# EAGLE design CN-Cape005-via08 (EAGLE 7.2.0)

## Sheet 1 of 7: Spannungsversorgung Verpolungsschutz ? Größe der Sicherung ? 1A oder 3A für Servos?
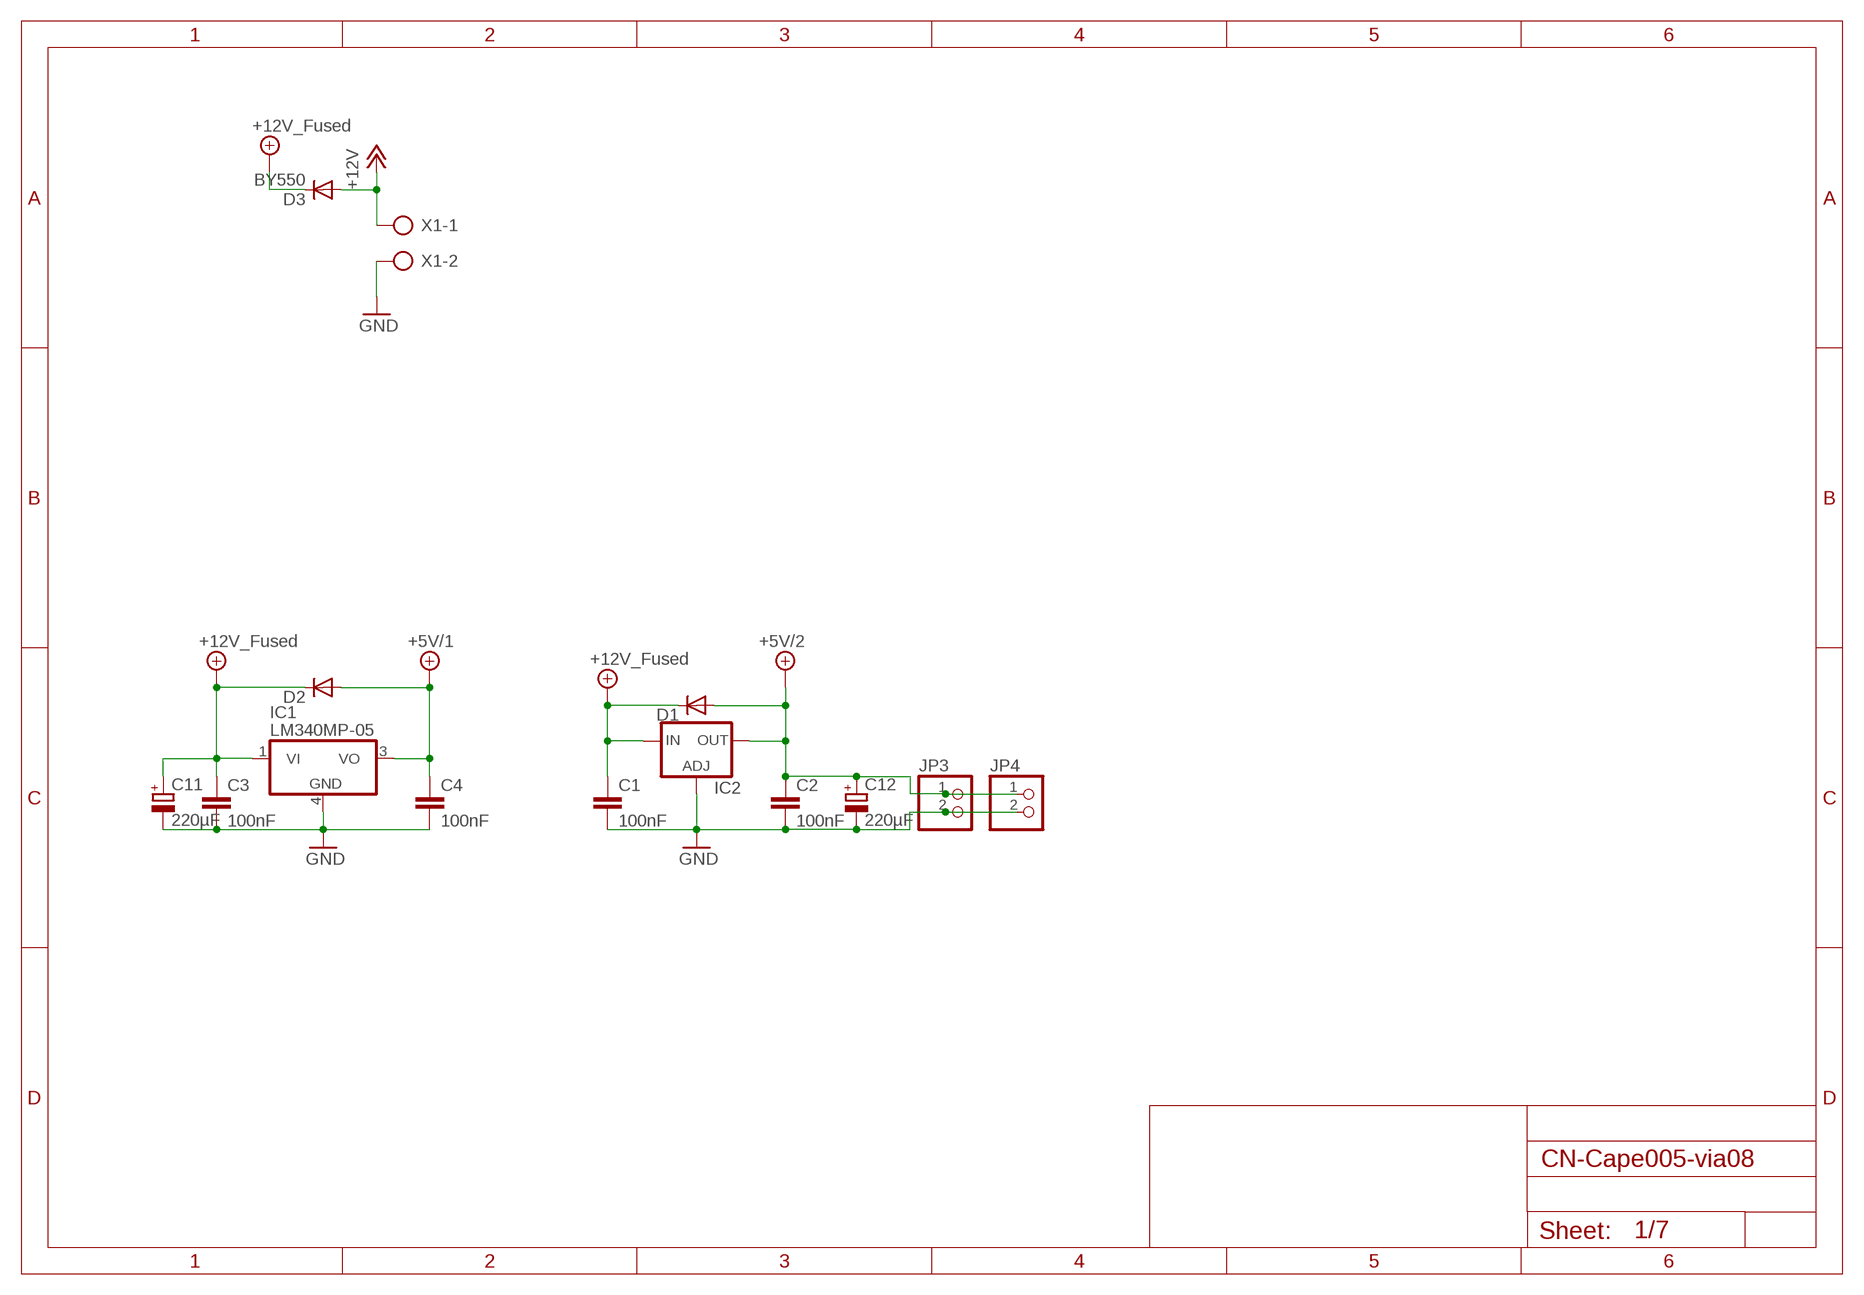
[diagram p0: schematic, sheet 1]

### Parts
C1  100nF  C-EUC0603  [C0603]
C2  100nF  C-EUC0603  [C0603]
C3  100nF  C-EUC0603  [C0603]
C4  100nF  C-EUC0603  [C0603]
C11  220µF  CPOL-EUE3.5-8  [E3,5-8]
C12  220µF  CPOL-EUE3.5-8  [E3,5-8]
D1  DIODE-SOD123  [SOD123]
D2  DIODE-SOD123  [SOD123]
D3  BY550  [DO27-15]
IC1  LM340MP-05  [SOT223]
IC2  LM138-TL  [TO220L1]
JP3  PINHD-1X2  [1X02]
JP4  PINHD-1X2  [1X02]
X1  AK500/2-H  [AK500/2-H]

### Nets
+5V/1: C4.1 D2.A IC1.3(VO) ; also sheet 2,3,4,5
+5V/2: C2.1 C12.+ D1.A IC2.2(OUT) JP3.1 JP4.1 ; also sheet 5
+10V: C1.1 C3.1 C11.+ D1.C D2.C D3.C IC1.1(VI) IC2.3(IN) ; supply symbol labelled +12V_Fused
+12V: D3.A X1.1
GND: C1.2 C2.2 C3.2 C4.2 C11.- C12.- IC1.4(GND) IC2.1(ADJ) JP3.2 JP4.2 X1.2 ; also sheet 2,3,4,5,6,7

## Sheet 2 of 7: BeagleBoard Black Expansion Header
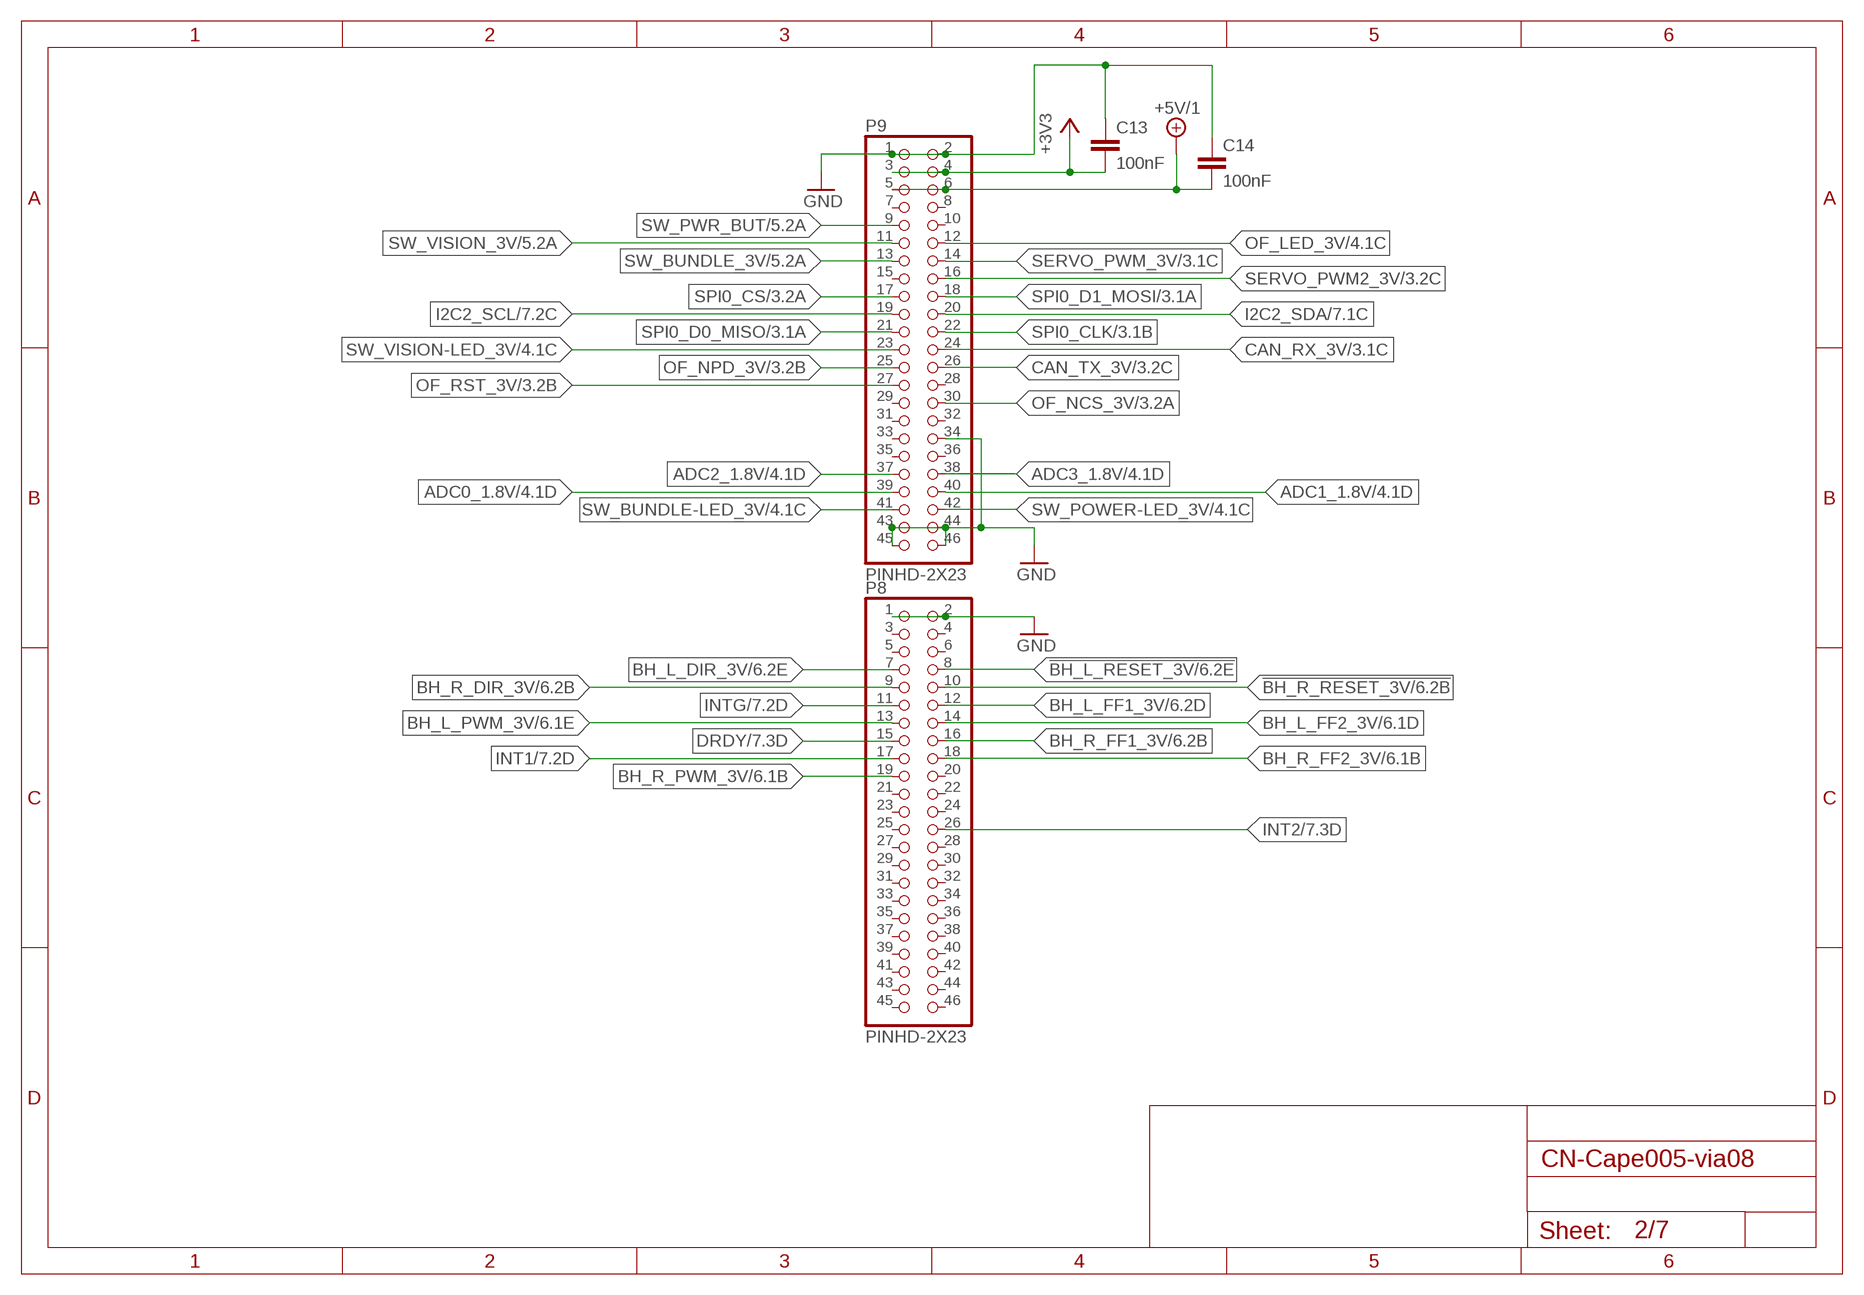
[diagram p1: schematic, sheet 2]

### Parts
C13  100nF  C-EUC0603  [C0603]
C14  100nF  C-EUC0603  [C0603]
P8  PINHD-2X23  [2X23]
P9  PINHD-2X23  [2X23]

### Nets
!BH_L_RESET_3V: P8.8 ; also sheet 6
!BH_R_RESET_3V: P8.10 ; also sheet 6
+3V3: C13.2 P9.3 P9.4 ; also sheet 3,6,7
+5V/1: C14.2 P9.5 P9.6 ; also sheet 1,3,4,5
ADC0_1.8V: P9.39 ; also sheet 4
ADC1_1.8V: P9.40 ; also sheet 4
ADC2_1.8V: P9.37 ; also sheet 4
ADC3_1.8V: P9.38 ; also sheet 4
BH_L_DIR_3V: P8.7 ; also sheet 6
BH_L_FF1_3V: P8.12 ; also sheet 6
BH_L_FF2_3V: P8.14 ; also sheet 6
BH_L_PWM_3V: P8.13 ; also sheet 6
BH_R_DIR_3V: P8.9 ; also sheet 6
BH_R_FF1_3V: P8.16 ; also sheet 6
BH_R_FF2_3V: P8.18 ; also sheet 6
BH_R_PWM_3V: P8.19 ; also sheet 6
CAN_RX_3V: P9.24 ; also sheet 3
CAN_TX_3V: P9.26 ; also sheet 3
DRDY: P8.15 ; also sheet 7
GND: C13.1 C14.1 P8.1 P8.2 P9.1 P9.2 P9.34 P9.43 P9.44 P9.45 P9.46 ; also sheet 1,3,4,5,6,7
I2C2_SCL: P9.19 ; also sheet 7
I2C2_SDA: P9.20 ; also sheet 7
INT1: P8.17 ; also sheet 7
INT2: P8.26 ; also sheet 7
INTG: P8.11 ; also sheet 7
OF_LED_3V: P9.12 ; also sheet 4
OF_NCS_3V: P9.30 ; also sheet 3
OF_NPD_3V: P9.25 ; also sheet 3
OF_RST_3V: P9.27 ; also sheet 3
SERVO_PWM2_3V: P9.16 ; also sheet 3
SERVO_PWM_3V: P9.14 ; also sheet 3
SPI0_CLK: P9.22 ; also sheet 3
SPI0_CS: P9.17 ; also sheet 3
SPI0_D0_MISO: P9.21 ; also sheet 3
SPI0_D1_MOSI: P9.18 ; also sheet 3
SW_BUNDLE-LED_3V: P9.41 ; also sheet 4
SW_BUNDLE_3V: P9.13 ; also sheet 5
SW_POWER-LED_3V: P9.42 ; also sheet 4
SW_PWR_BUT: P9.9 ; also sheet 5
SW_VISION-LED_3V: P9.23 ; also sheet 4
SW_VISION_3V: P9.11 ; also sheet 5
Unconnected: P8.3 P8.4 P8.5 P8.6 P8.20 P8.21 P8.22 P8.23 P8.24 P8.25 P8.27 P8.28 P8.29 P8.30 P8.31 P8.32 P8.33 P8.34 P8.35 P8.36 P8.37 P8.38 P8.39 P8.40 P8.41 P8.42 P8.43 P8.44 P8.45 P8.46 P9.7 P9.8 P9.10 P9.15 P9.28 P9.29 P9.31 P9.32 P9.33 P9.35 P9.36

## Sheet 3 of 7: Level Shifter
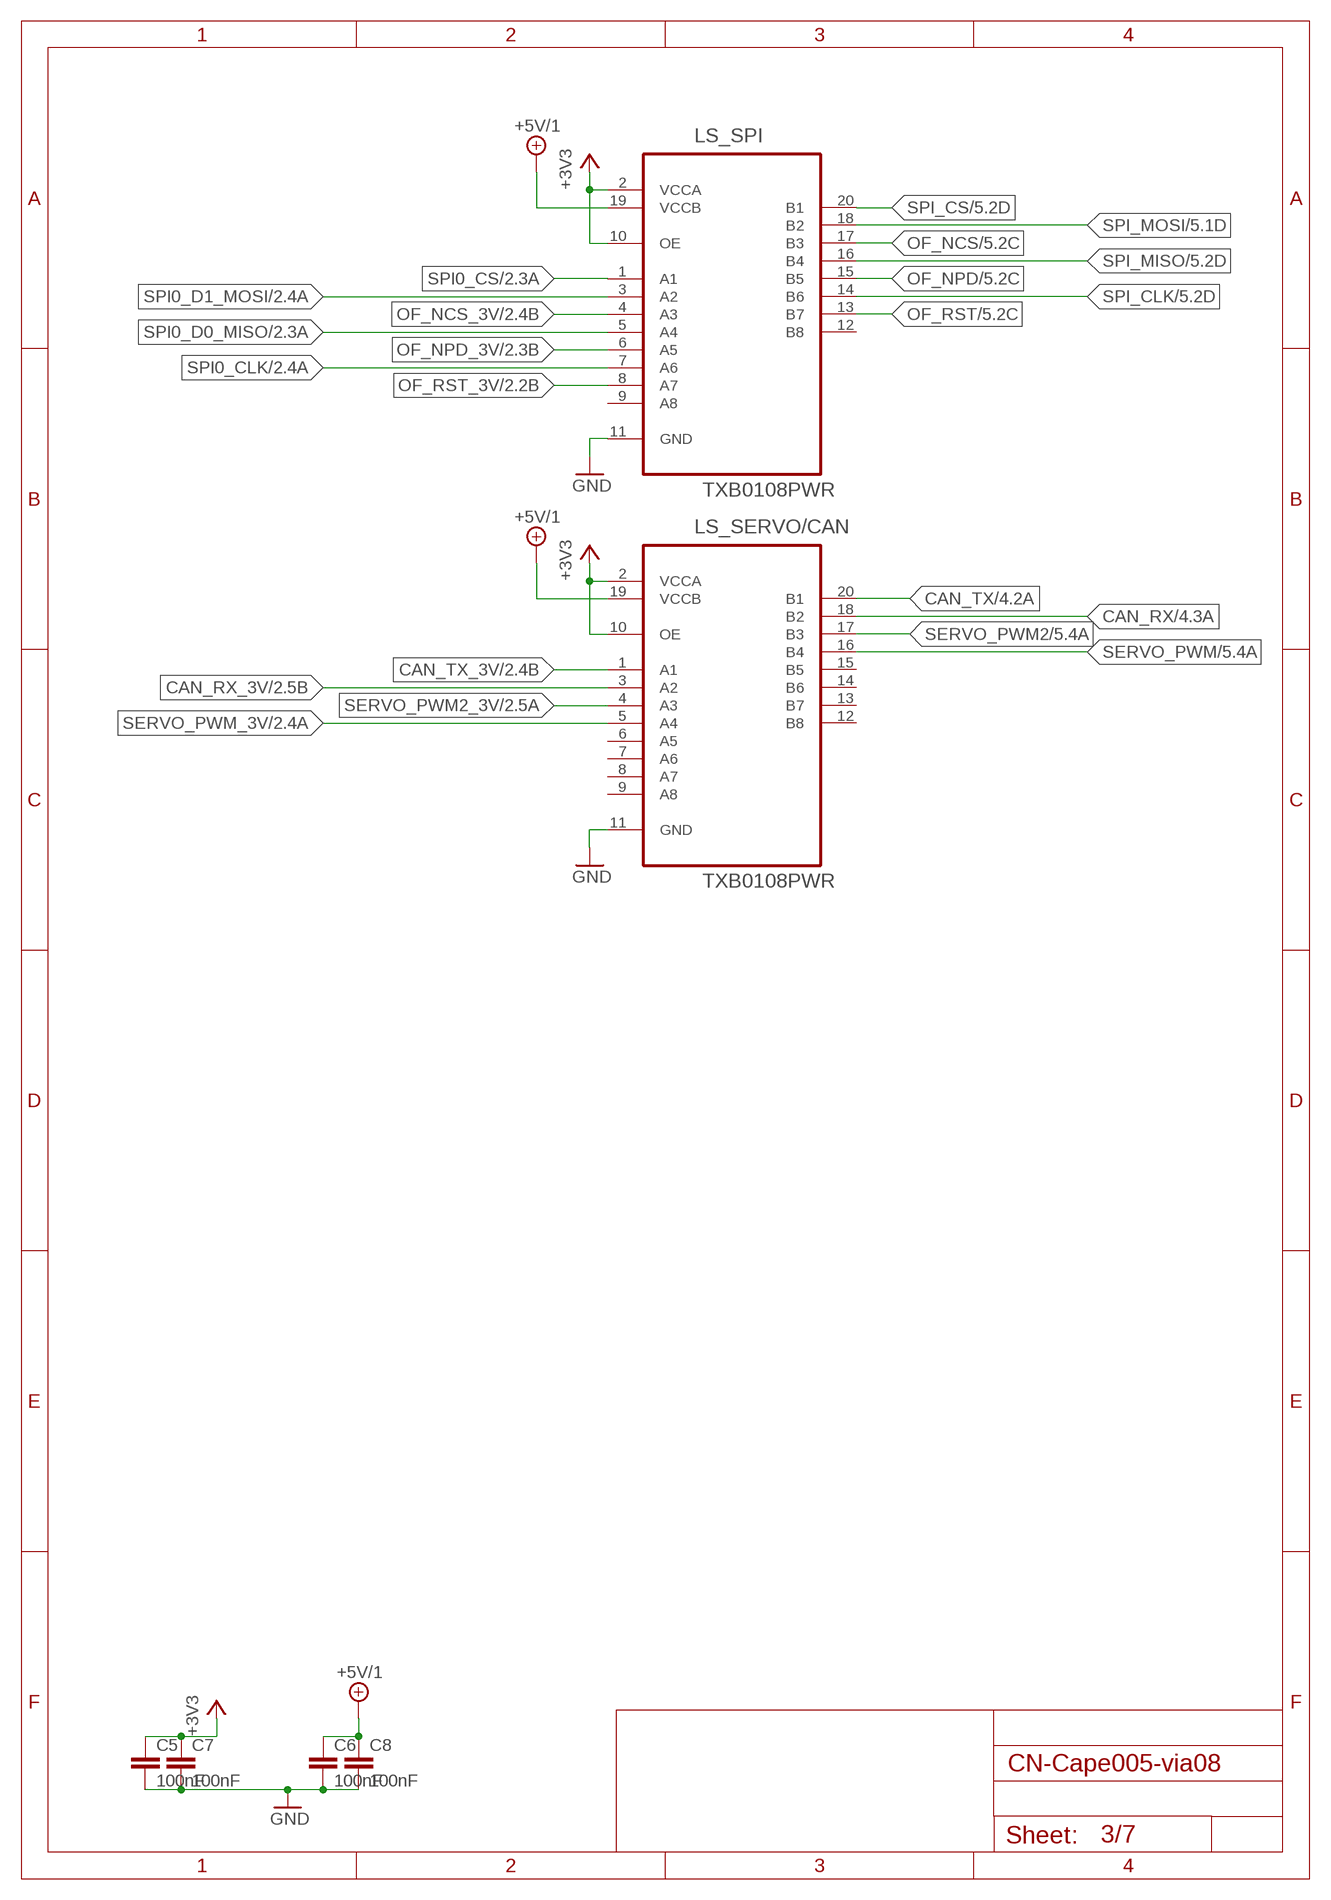
[diagram p2: schematic, sheet 3]

### Parts
C5  100nF  C-EUC0603  [C0603]
C6  100nF  C-EUC0603  [C0603]
C7  100nF  C-EUC0603  [C0603]
C8  100nF  C-EUC0603  [C0603]
LS_SERVO/CAN  TXB0108PWR  [SOP65P640X120-20N]
LS_SPI  TXB0108PWR  [SOP65P640X120-20N]

### Nets
+3V3: C5.1 C7.1 LS_SERVO/CAN.2(VCCA) LS_SERVO/CAN.10(OE) LS_SPI.2(VCCA) LS_SPI.10(OE) ; also sheet 2,6,7
+5V/1: C6.1 C8.1 LS_SERVO/CAN.19(VCCB) LS_SPI.19(VCCB) ; also sheet 1,2,4,5
CAN_RX: LS_SERVO/CAN.18(B2) ; also sheet 4
CAN_RX_3V: LS_SERVO/CAN.3(A2) ; also sheet 2
CAN_TX: LS_SERVO/CAN.20(B1) ; also sheet 4
CAN_TX_3V: LS_SERVO/CAN.1(A1) ; also sheet 2
GND: C5.2 C6.2 C7.2 C8.2 LS_SERVO/CAN.11(GND) LS_SPI.11(GND) ; also sheet 1,2,4,5,6,7
OF_NCS: LS_SPI.17(B3) ; also sheet 5
OF_NCS_3V: LS_SPI.4(A3) ; also sheet 2
OF_NPD: LS_SPI.15(B5) ; also sheet 5
OF_NPD_3V: LS_SPI.6(A5) ; also sheet 2
OF_RST: LS_SPI.13(B7) ; also sheet 5
OF_RST_3V: LS_SPI.8(A7) ; also sheet 2
SERVO_PWM: LS_SERVO/CAN.16(B4) ; also sheet 5
SERVO_PWM2: LS_SERVO/CAN.17(B3) ; also sheet 5
SERVO_PWM2_3V: LS_SERVO/CAN.4(A3) ; also sheet 2
SERVO_PWM_3V: LS_SERVO/CAN.5(A4) ; also sheet 2
SPI0_CLK: LS_SPI.7(A6) ; also sheet 2
SPI0_CS: LS_SPI.1(A1) ; also sheet 2
SPI0_D0_MISO: LS_SPI.5(A4) ; also sheet 2
SPI0_D1_MOSI: LS_SPI.3(A2) ; also sheet 2
SPI_CLK: LS_SPI.14(B6) ; also sheet 5
SPI_CS: LS_SPI.20(B1) ; also sheet 5
SPI_MISO: LS_SPI.16(B4) ; also sheet 5
SPI_MOSI: LS_SPI.18(B2) ; also sheet 5
Unconnected: LS_SERVO/CAN.6(A5) LS_SERVO/CAN.7(A6) LS_SERVO/CAN.8(A7) LS_SERVO/CAN.9(A8) LS_SERVO/CAN.12(B8) LS_SERVO/CAN.13(B7) LS_SERVO/CAN.14(B6) LS_SERVO/CAN.15(B5) LS_SPI.9(A8) LS_SPI.12(B8)

## Sheet 4 of 7: CAN- Bus & LED Transistoren
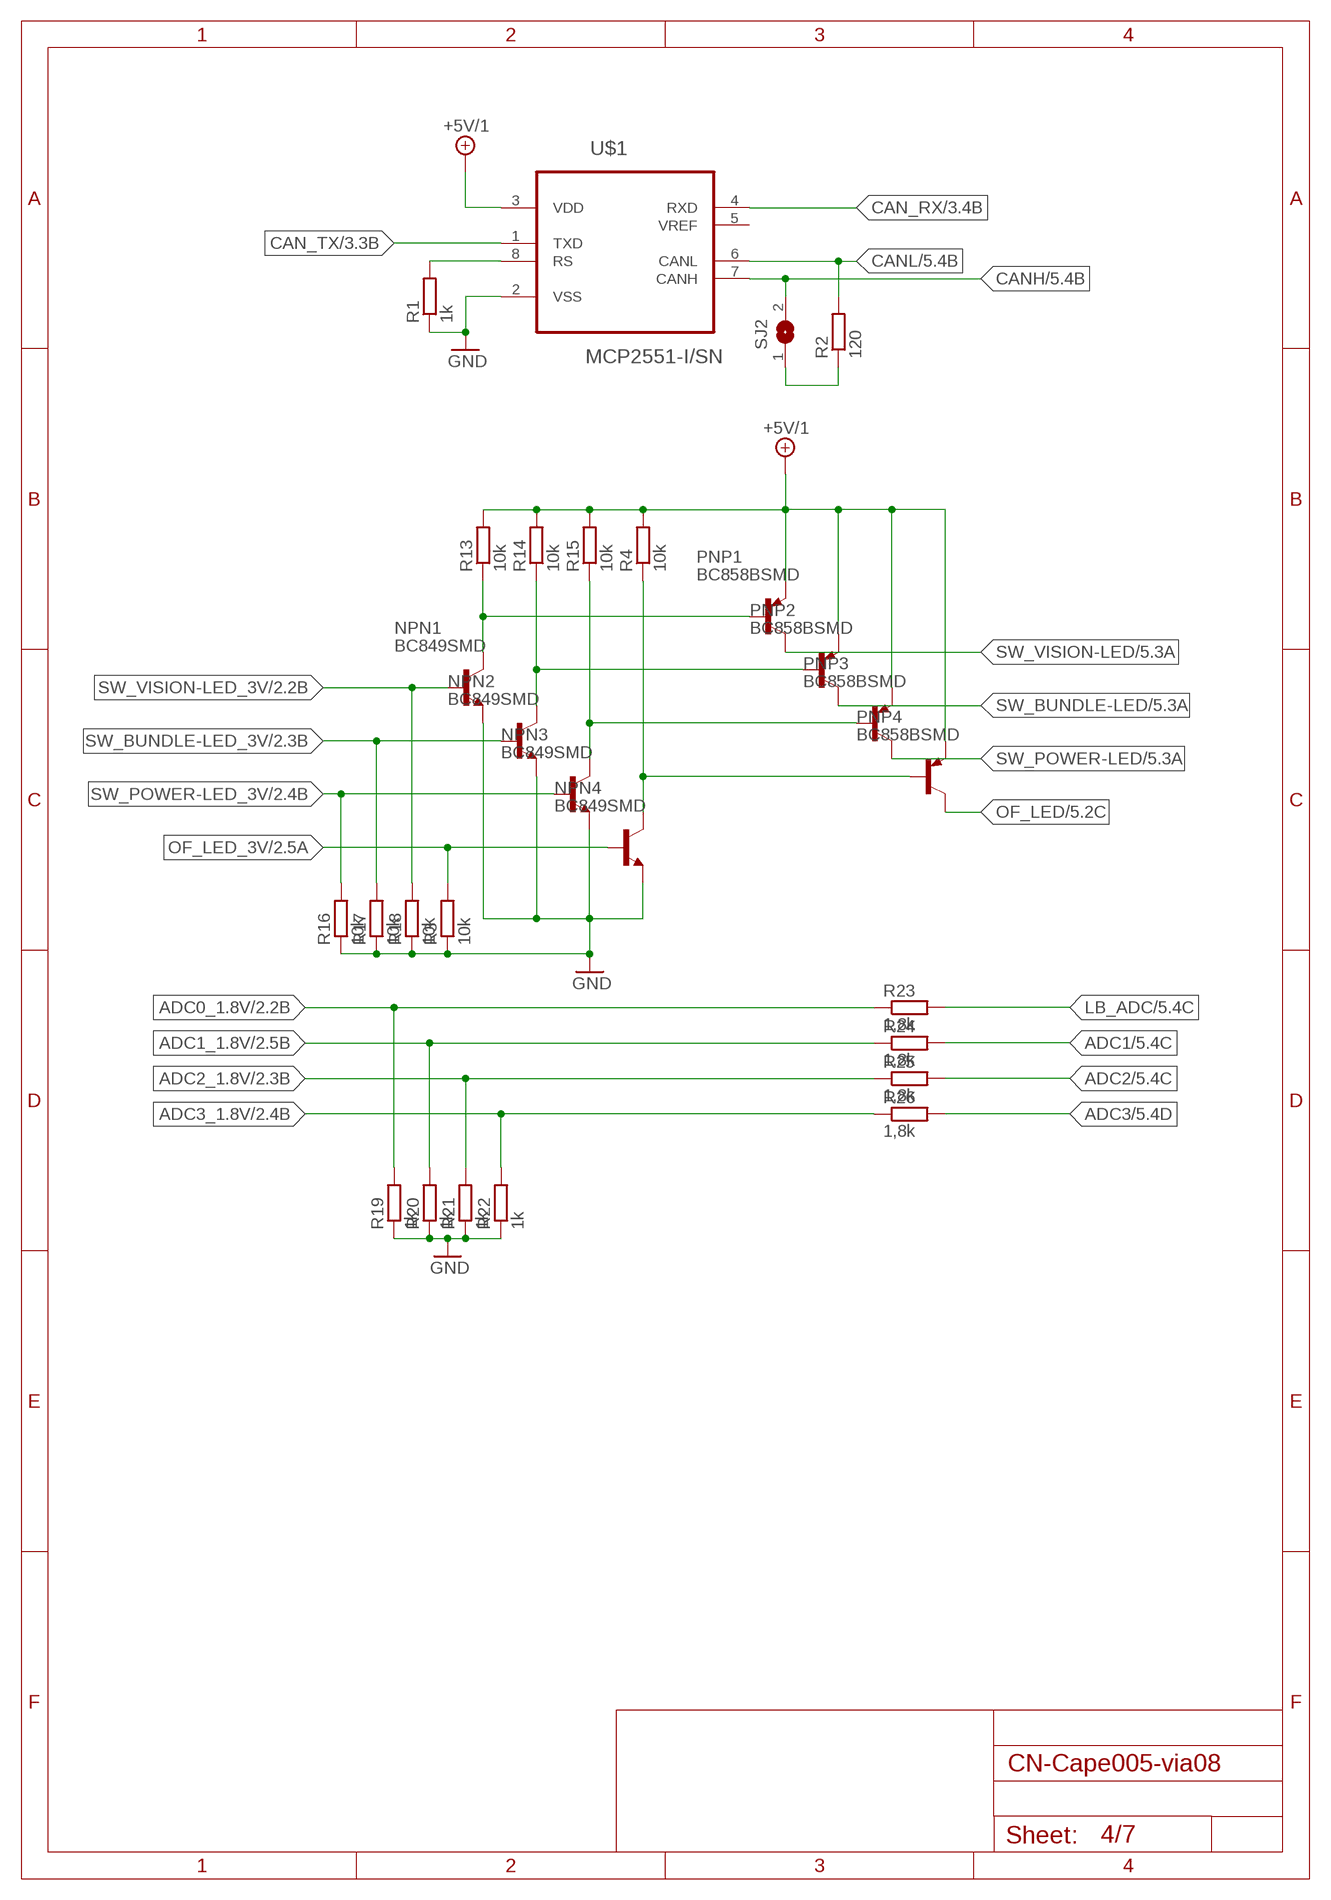
[diagram p3: schematic, sheet 4]

### Parts
NPN1  BC849SMD  [SOT23-BEC]
NPN2  BC849SMD  [SOT23-BEC]
NPN3  BC849SMD  [SOT23-BEC]
NPN4  BC849SMD  [SOT23-BEC]
PNP1  BC858BSMD  [SOT23-BEC]
PNP2  BC858BSMD  [SOT23-BEC]
PNP3  BC858BSMD  [SOT23-BEC]
PNP4  BC858BSMD  [SOT23-BEC]
R1  1k  R-EU_R0805  [R0805]
R2  120  R-EU_R0805  [R0805]
R3  10k  R-EU_R0805  [R0805]
R4  10k  R-EU_R0805  [R0805]
R13  10k  R-EU_R0805  [R0805]
R14  10k  R-EU_R0805  [R0805]
R15  10k  R-EU_R0805  [R0805]
R16  10k  R-EU_R0805  [R0805]
R17  10k  R-EU_R0805  [R0805]
R18  10k  R-EU_R0805  [R0805]
R19  1k  R-EU_R0805  [R0805]
R20  1k  R-EU_R0805  [R0805]
R21  1k  R-EU_R0805  [R0805]
R22  1k  R-EU_R0805  [R0805]
R23  1,8k  R-EU_R0805  [R0805]
R24  1,8k  R-EU_R0805  [R0805]
R25  1,8k  R-EU_R0805  [R0805]
R26  1,8k  R-EU_R0805  [R0805]
SJ2  SJ  [SJ]
U$1  MCP2551-I/SN  [SOIC127P600X175-8N]

### Nets
+5V/1: PNP1.E PNP2.E PNP3.E PNP4.E R4.2 R13.2 R14.2 R15.2 U$1.3(VDD) ; also sheet 1,2,3,5
ADC0_1.8V: R19.2 R23.1 ; also sheet 2
ADC1: R24.2 ; also sheet 5
ADC1_1.8V: R20.2 R24.1 ; also sheet 2
ADC2: R25.2 ; also sheet 5
ADC2_1.8V: R21.2 R25.1 ; also sheet 2
ADC3: R26.2 ; also sheet 5
ADC3_1.8V: R22.2 R26.1 ; also sheet 2
CAN_RX: U$1.4(RXD) ; also sheet 3
CAN_TX: U$1.1(TXD) ; also sheet 3
CANH: SJ2.2 U$1.7(CANH) ; also sheet 5
CANL: R2.2 U$1.6(CANL) ; also sheet 5
GND: NPN1.E NPN2.E NPN3.E NPN4.E R1.1 R3.1 R16.1 R17.1 R18.1 R19.1 R20.1 R21.1 R22.1 U$1.2(VSS) ; also sheet 1,2,3,5,6,7
LB_ADC: R23.2 ; also sheet 5
N$1: NPN1.C PNP1.B R13.1
N$2: NPN2.C PNP2.B R14.1
N$3: NPN4.C PNP4.B R4.1
N$4: NPN3.C PNP3.B R15.1
N$9: R1.2 U$1.8(RS)
N$10: R2.1 SJ2.1
OF_LED: PNP4.C ; also sheet 5
OF_LED_3V: NPN4.B R3.2 ; also sheet 2
SW_BUNDLE-LED: PNP2.C ; also sheet 5
SW_BUNDLE-LED_3V: NPN2.B R17.2 ; also sheet 2
SW_POWER-LED: PNP3.C ; also sheet 5
SW_POWER-LED_3V: NPN3.B R16.2 ; also sheet 2
SW_VISION-LED: PNP1.C ; also sheet 5
SW_VISION-LED_3V: NPN1.B R18.2 ; also sheet 2
Unconnected: U$1.5(VREF)

## Sheet 5 of 7: Connector
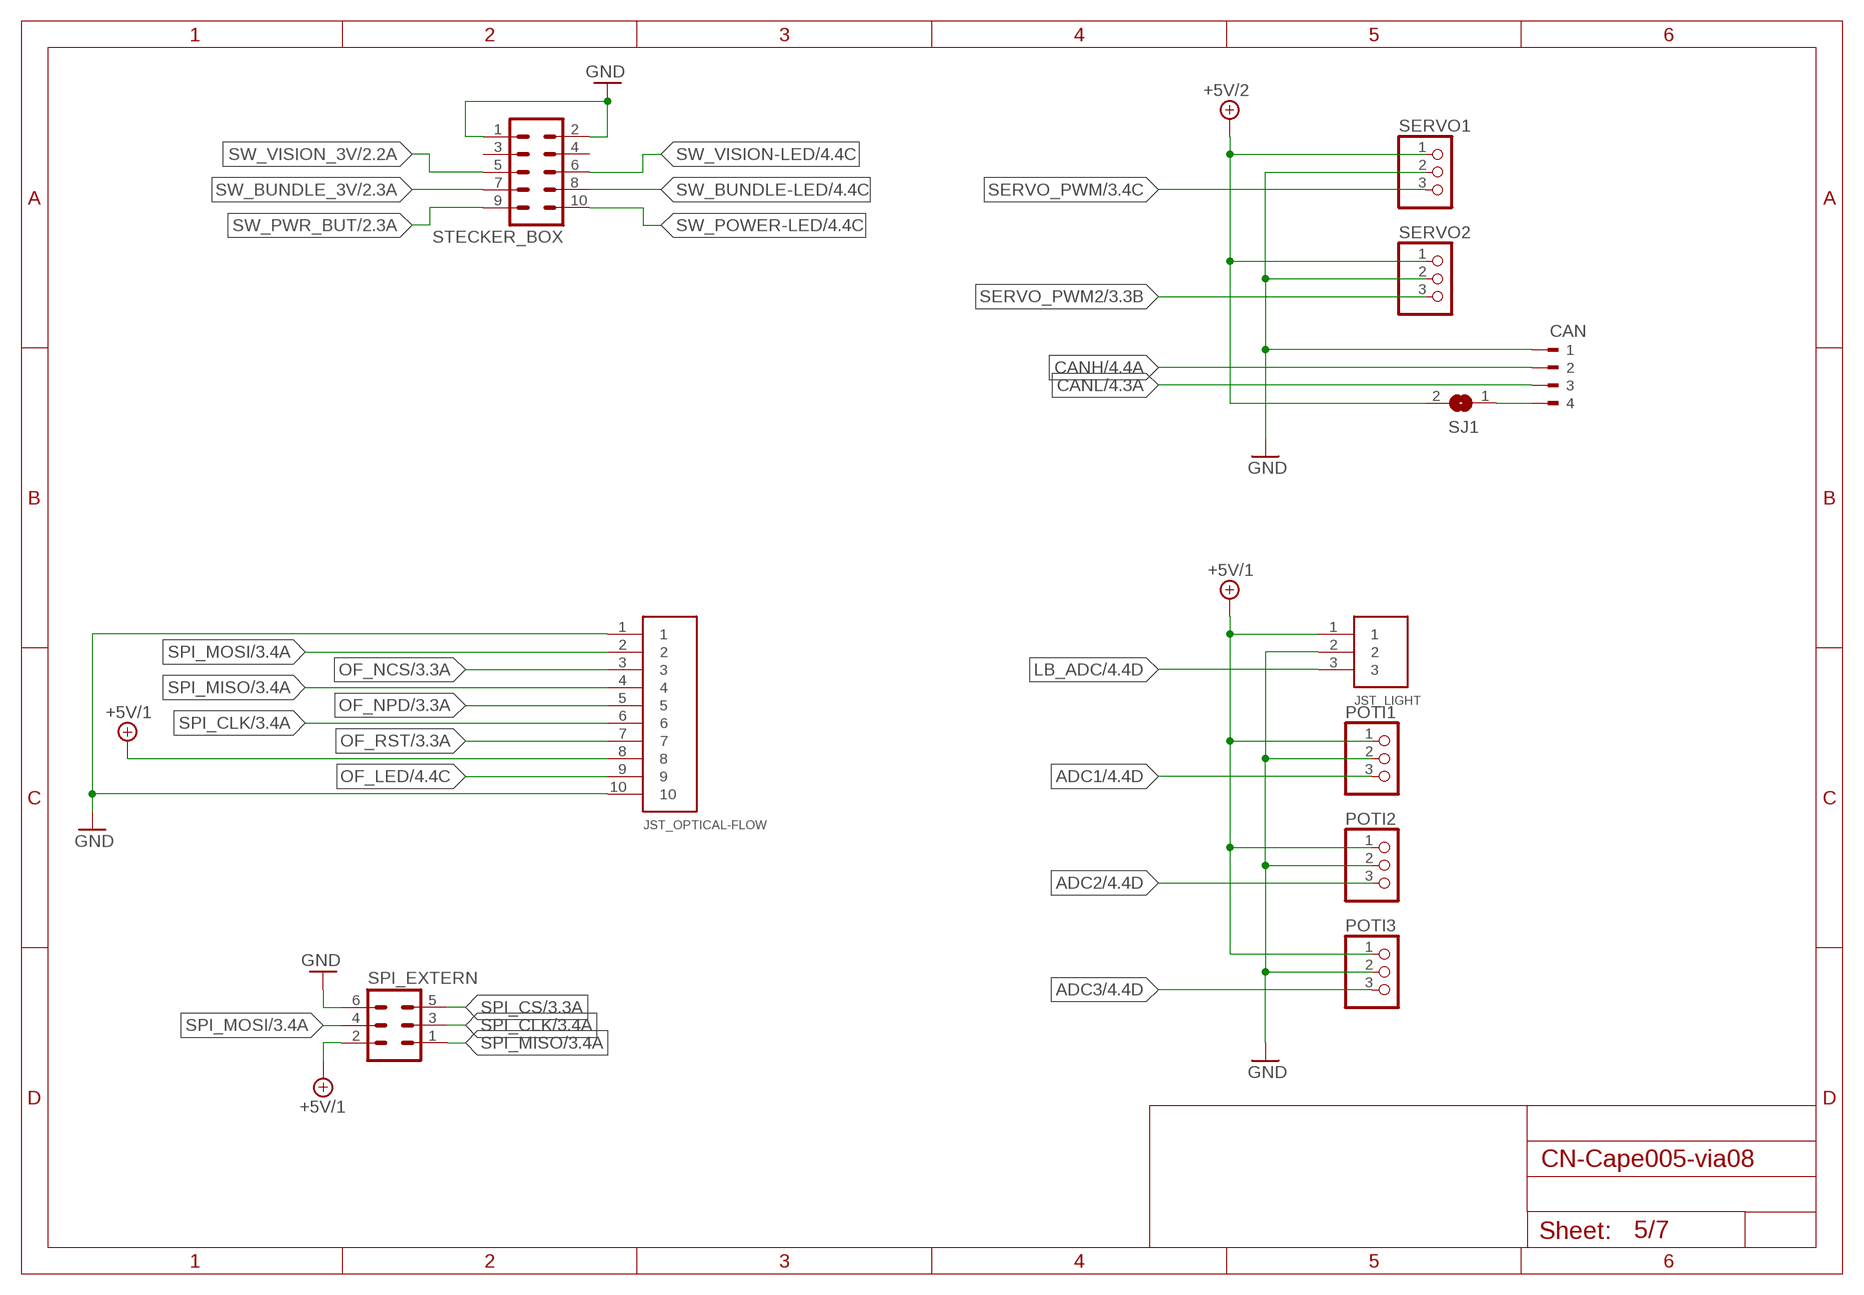
[diagram p4: schematic, sheet 5]

### Parts
CAN  90-4  [90-4]
JST_LIGHT  S3PIN  [S3B-EH]
JST_OPTICAL-FLOW  S10PIN  [S10B-EH]
POTI1  PINHD-1X3  [1X03]
POTI2  PINHD-1X3  [1X03]
POTI3  PINHD-1X3  [1X03]
SERVO1  PINHD-1X3  [1X03]
SERVO2  PINHD-1X3  [1X03]
SJ1  SJ  [SJ]
SPI_EXTERN  ML6  [ML6]
STECKER_BOX  ML10  [ML10]

### Nets
5V/2_F&J: CAN.4 SJ1.1
+5V/1: JST_LIGHT.1 JST_OPTICAL-FLOW.8 POTI1.1 POTI2.1 POTI3.1 SPI_EXTERN.2 ; also sheet 1,2,3,4
+5V/2: SERVO1.1 SERVO2.1 SJ1.2 ; also sheet 1
ADC1: POTI1.3 ; also sheet 4
ADC2: POTI2.3 ; also sheet 4
ADC3: POTI3.3 ; also sheet 4
CANH: CAN.2 ; also sheet 4
CANL: CAN.3 ; also sheet 4
GND: CAN.1 JST_LIGHT.2 JST_OPTICAL-FLOW.1 JST_OPTICAL-FLOW.10 POTI1.2 POTI2.2 POTI3.2 SERVO1.2 SERVO2.2 SPI_EXTERN.6 STECKER_BOX.1 STECKER_BOX.2 ; also sheet 1,2,3,4,6,7
LB_ADC: JST_LIGHT.3 ; also sheet 4
OF_LED: JST_OPTICAL-FLOW.9 ; also sheet 4
OF_NCS: JST_OPTICAL-FLOW.3 ; also sheet 3
OF_NPD: JST_OPTICAL-FLOW.5 ; also sheet 3
OF_RST: JST_OPTICAL-FLOW.7 ; also sheet 3
SERVO_PWM: SERVO1.3 ; also sheet 3
SERVO_PWM2: SERVO2.3 ; also sheet 3
SPI_CLK: JST_OPTICAL-FLOW.6 SPI_EXTERN.3 ; also sheet 3
SPI_CS: SPI_EXTERN.5 ; also sheet 3
SPI_MISO: JST_OPTICAL-FLOW.4 SPI_EXTERN.1 ; also sheet 3
SPI_MOSI: JST_OPTICAL-FLOW.2 SPI_EXTERN.4 ; also sheet 3
SW_BUNDLE-LED: STECKER_BOX.8 ; also sheet 4
SW_BUNDLE_3V: STECKER_BOX.7 ; also sheet 2
SW_POWER-LED: STECKER_BOX.10 ; also sheet 4
SW_PWR_BUT: STECKER_BOX.9 ; also sheet 2
SW_VISION-LED: STECKER_BOX.6 ; also sheet 4
SW_VISION_3V: STECKER_BOX.5 ; also sheet 2
Unconnected: STECKER_BOX.3 STECKER_BOX.4

## Sheet 6 of 7: BallHandle
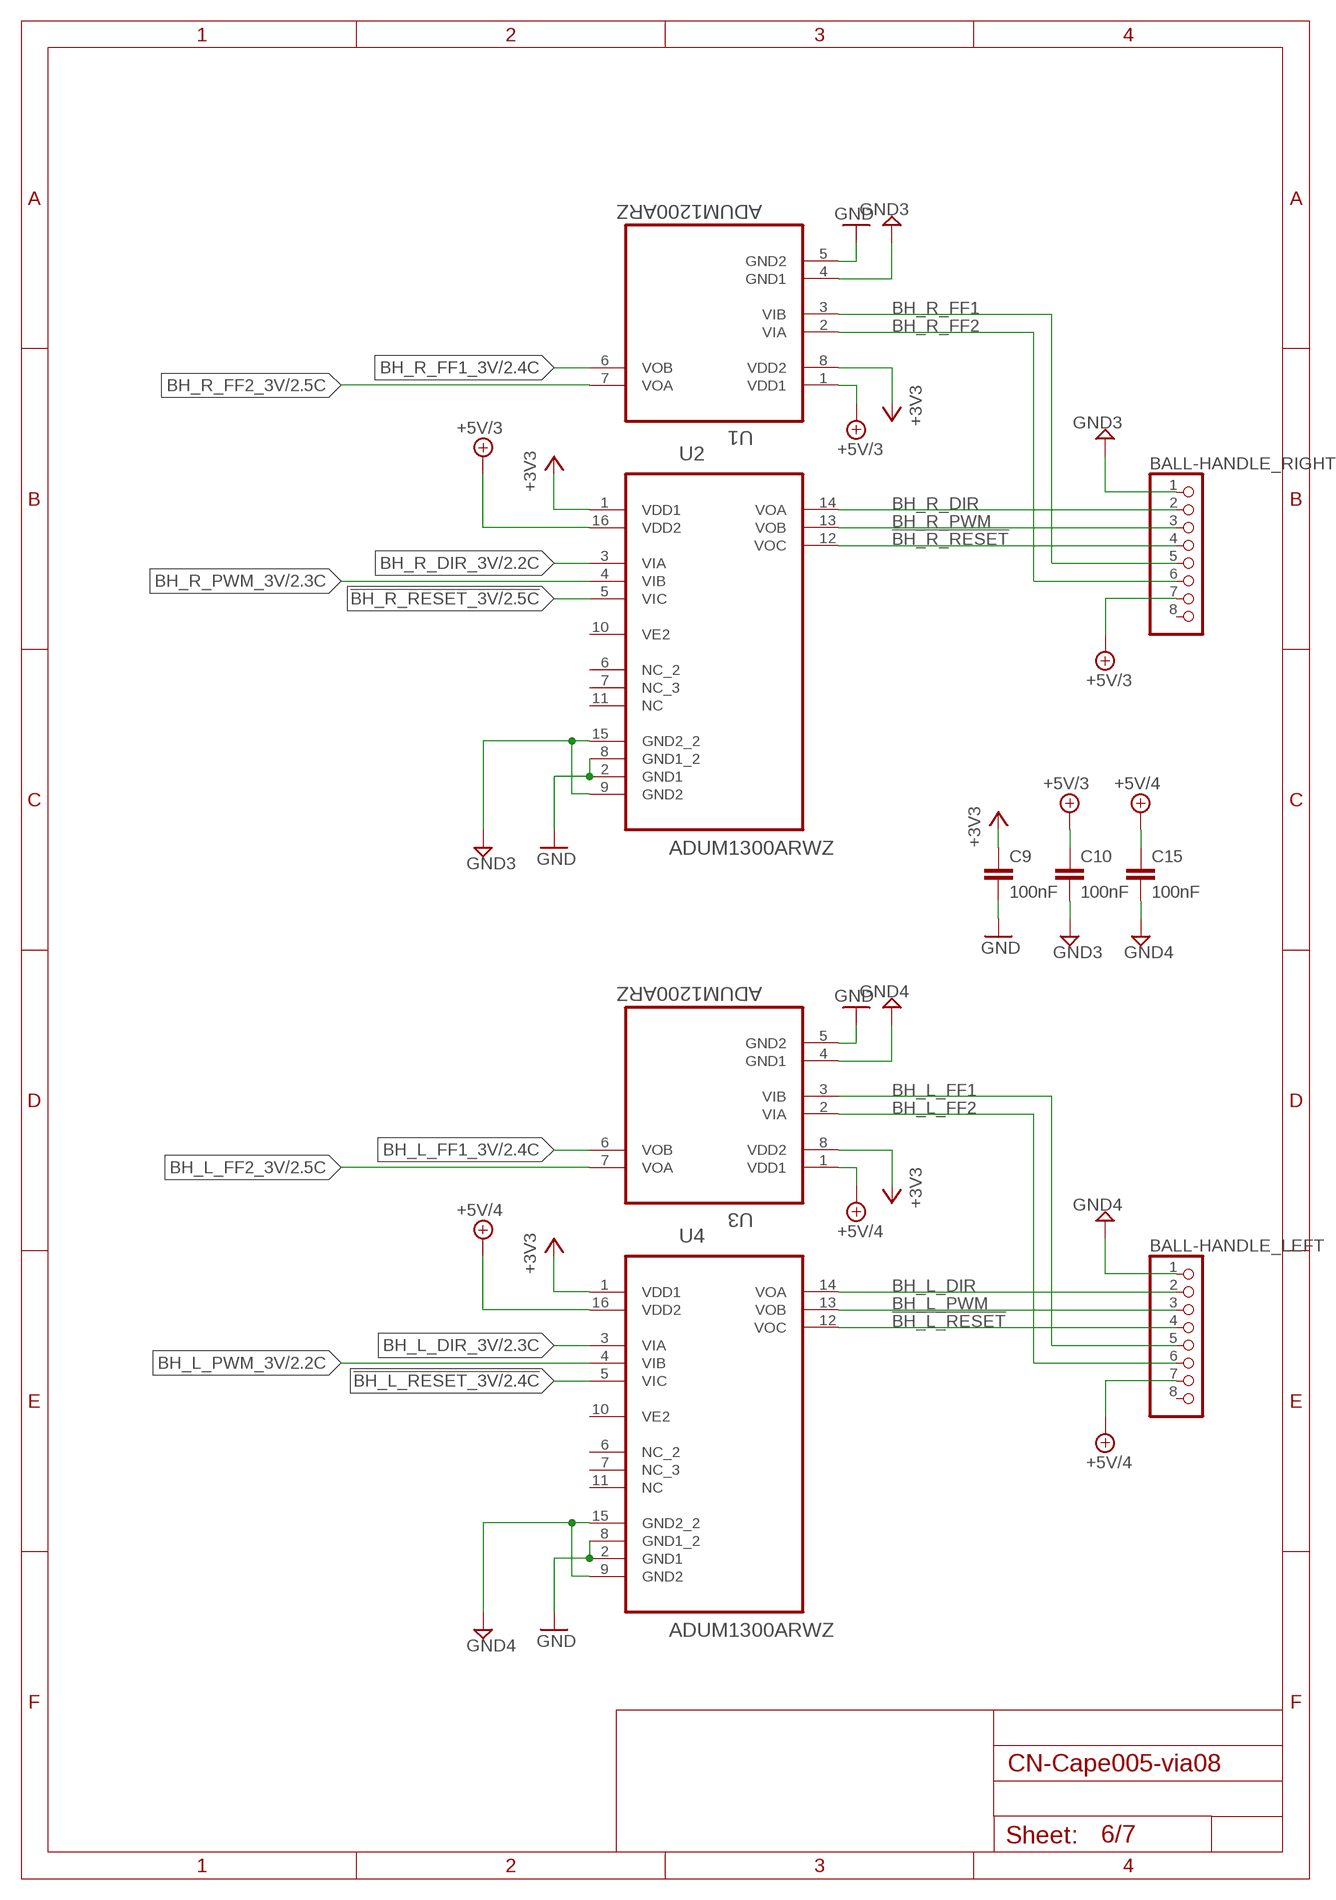
[diagram p5: schematic, sheet 6]

### Parts
BALL-HANDLE_LEFT  PINHD-1X8  [1X08]
BALL-HANDLE_RIGHT  PINHD-1X8  [1X08]
C9  100nF  C-EUC0603  [C0603]
C10  100nF  C-EUC0603  [C0603]
C15  100nF  C-EUC0603  [C0603]
U1  ADUM1200ARZ  [SOIC127P600X175-8N]
U2  ADUM1300ARWZ  [SOIC127P1032X265-16N]
U3  ADUM1200ARZ  [SOIC127P600X175-8N]
U4  ADUM1300ARWZ  [SOIC127P1032X265-16N]

### Nets
!BH_L_RESET: BALL-HANDLE_LEFT.4 U4.12(VOC)
!BH_L_RESET_3V: U4.5(VIC) ; also sheet 2
!BH_R_RESET: BALL-HANDLE_RIGHT.4 U2.12(VOC)
!BH_R_RESET_3V: U2.5(VIC) ; also sheet 2
+3V3: C9.1 U1.8(VDD2) U2.1(VDD1) U3.8(VDD2) U4.1(VDD1) ; also sheet 2,3,7
+5V/3: BALL-HANDLE_RIGHT.7 C10.1 U1.1(VDD1) U2.16(VDD2)
+5V/4: BALL-HANDLE_LEFT.7 C15.1 U3.1(VDD1) U4.16(VDD2)
BH_L_DIR: BALL-HANDLE_LEFT.2 U4.14(VOA)
BH_L_DIR_3V: U4.3(VIA) ; also sheet 2
BH_L_FF1: BALL-HANDLE_LEFT.5 U3.3(VIB)
BH_L_FF1_3V: U3.6(VOB) ; also sheet 2
BH_L_FF2: BALL-HANDLE_LEFT.6 U3.2(VIA)
BH_L_FF2_3V: U3.7(VOA) ; also sheet 2
BH_L_PWM: BALL-HANDLE_LEFT.3 U4.13(VOB)
BH_L_PWM_3V: U4.4(VIB) ; also sheet 2
BH_R_DIR: BALL-HANDLE_RIGHT.2 U2.14(VOA)
BH_R_DIR_3V: U2.3(VIA) ; also sheet 2
BH_R_FF1: BALL-HANDLE_RIGHT.5 U1.3(VIB)
BH_R_FF1_3V: U1.6(VOB) ; also sheet 2
BH_R_FF2: BALL-HANDLE_RIGHT.6 U1.2(VIA)
BH_R_FF2_3V: U1.7(VOA) ; also sheet 2
BH_R_PWM: BALL-HANDLE_RIGHT.3 U2.13(VOB)
BH_R_PWM_3V: U2.4(VIB) ; also sheet 2
GND: C9.2 U1.5(GND2) U2.2(GND1) U2.8(GND1_2) U3.5(GND2) U4.2(GND1) U4.8(GND1_2) ; also sheet 1,2,3,4,5,7
GND3: BALL-HANDLE_RIGHT.1 C10.2 U1.4(GND1) U2.9(GND2) U2.15(GND2_2)
GND4: BALL-HANDLE_LEFT.1 C15.2 U3.4(GND1) U4.9(GND2) U4.15(GND2_2)
Unconnected: BALL-HANDLE_LEFT.8 BALL-HANDLE_RIGHT.8 U2.6(NC_2) U2.7(NC_3) U2.10(VE2) U2.11(NC) U4.6(NC_2) U4.7(NC_3) U4.10(VE2) U4.11(NC)

## Sheet 7 of 7
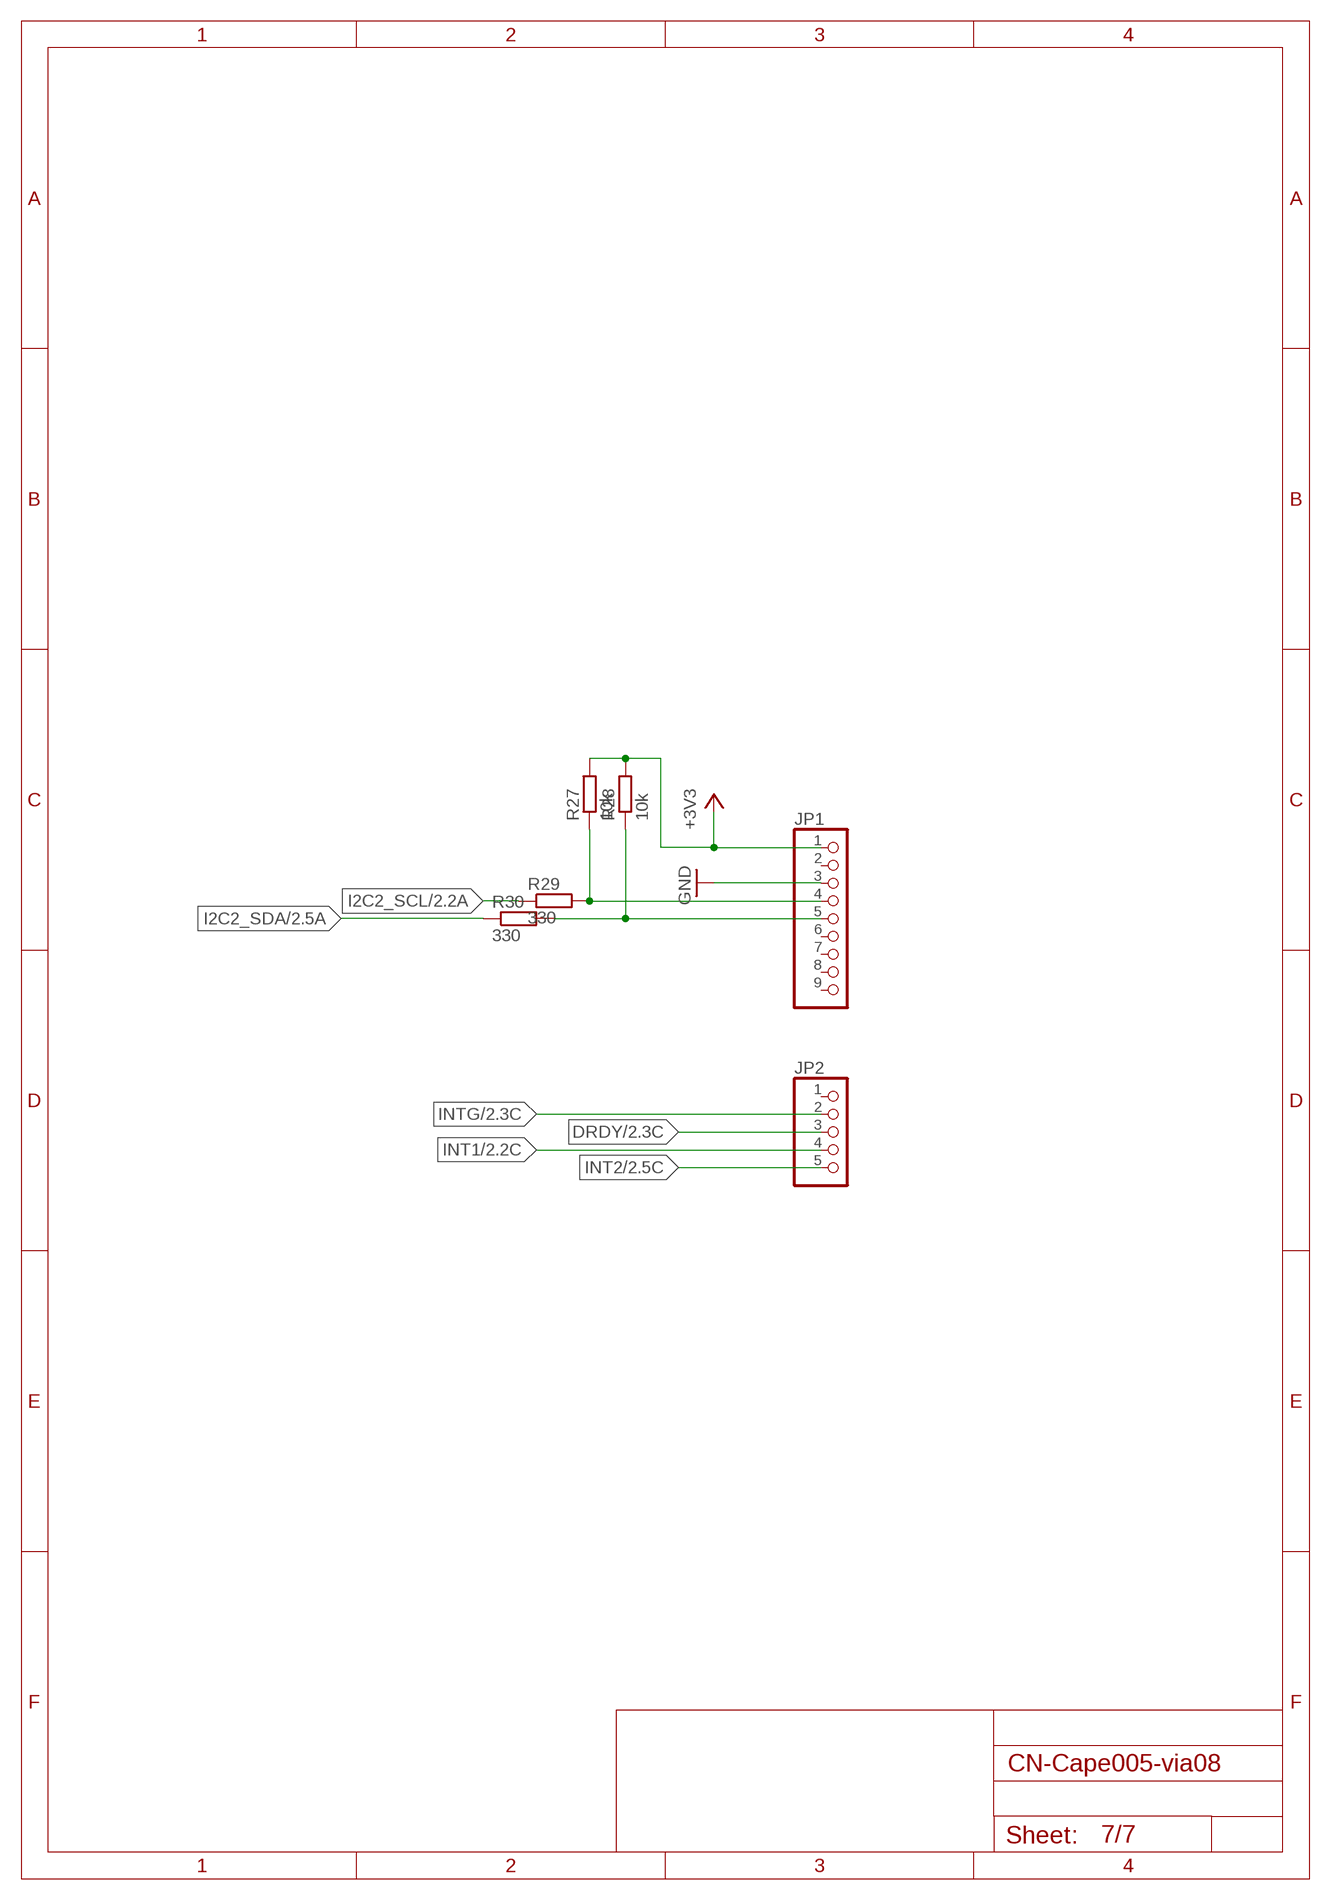
[diagram p6: schematic, sheet 7]

### Parts
JP1  PINHD-1X9  [1X09]
JP2  PINHD-1X5  [1X05]
R27  10k  R-EU_R0805  [R0805]
R28  10k  R-EU_R0805  [R0805]
R29  330  R-EU_R0805  [R0805]
R30  330  R-EU_R0805  [R0805]

### Nets
+3V3: JP1.1 R27.2 R28.2 ; also sheet 2,3,6
DRDY: JP2.3 ; also sheet 2
GND: JP1.3 ; also sheet 1,2,3,4,5,6
I2C2_SCL: R29.1 ; also sheet 2
I2C2_SDA: R30.1 ; also sheet 2
INT1: JP2.4 ; also sheet 2
INT2: JP2.5 ; also sheet 2
INTG: JP2.2 ; also sheet 2
SCL: JP1.4 R27.1 R29.2
SDA: JP1.5 R28.1 R30.2
Unconnected: JP1.2 JP1.6 JP1.7 JP1.8 JP1.9 JP2.1

## Library data of the parts
BALL-HANDLE_LEFT BALL-HANDLE_RIGHT = pinhead:PINHD-1X8: PIN HEADER
C1-C10 C13-C15 = rcl:C-EU: CAPACITOR, European symbol
C11 C12 = rcl:CPOL-EU: POLARIZED CAPACITOR, European symbol
CAN = con-weidmueller-sl35:90-4: WEIDMUELLER CLAMP CONNECTOR
D1 D2 = diode:DIODE-: DIODE; REICHELT: SD 101BW
D3 = diode:BY550: DIODE Si200 V, 5 A
IC1 = linear:LM340?-*: Positive VOLTAGE REGULATOR Source: http://cache.national.com/ds/LM/LM340.pdf
IC2 = v-reg:LM138-TL: VOLTAGE REGULATOR
JP1 = pinhead:PINHD-1X9: PIN HEADER
JP2 = pinhead:PINHD-1X5: PIN HEADER
JP3 JP4 = pinhead:PINHD-1X2: PIN HEADER
JST_LIGHT = jst_eh:S3PIN
JST_OPTICAL-FLOW = jst_eh:S10PIN
LS_SERVO/CAN LS_SPI = TI-TXB0108PWR:TXB0108PWR: 8-BIT BIDIRECTIONAL VOLTAGE-LEVEL TRANSLATOR; MPN: TXB0108PWR; OC_FARNELL: 1494945; OC_NEWARK: 27M1151; PACKAGE: TSSOP-20; SUPPLIER: Texas Instruments
NPN1-NPN4 = transistor-npn:BC849*: NPN Transistor
P8 P9 = pinhead-2x23:PINHD-2X23
PNP1-PNP4 = transistor-pnp:BC858*: PNP Transistror
POTI1-POTI3 SERVO1 SERVO2 = pinhead:PINHD-1X3: PIN HEADER
R1-R4 R13-R30 = rcl:R-EU_: RESISTOR, European symbol
SJ1 SJ2 = jumper:SJ: SMD solder JUMPER
SPI_EXTERN = con-ml:ML6: HARTING
STECKER_BOX = con-ml:ML10: HARTING
U1 U3 = ADUM1200:ADUM1200ARZ: Dual-Channel Digital Isolators; MPN: ADUM1200ARZ; OC_FARNELL: 1078204; OC_NEWARK: 19M0750; PACKAGE: SOIC-8; SUPPLIER: Analog Devices
U2 U4 = ADUM1300:ADUM1300ARWZ: Triple-Channel Digital Isolators; MPN: ADUM1300ARWZ; OC_FARNELL: 1226209; OC_NEWARK: 19M8751; PACKAGE: SOIC-16; SUPPLIER: Analog Devices
U$1 = Microchip-MCP2551-I_SN:MCP2551-I/SN: High-Speed CAN Transceiver; MPN: MCP2551-I/SN; OC_FARNELL: 9758569; OC_NEWARK: 69K7604; PACKAGE: SOIC-8; SUPPLIER: Microchip
X1 = con-ptr500:AK500/2-H: CONNECTOR Aug. 2004 / PTR Meßtechnik: Die Bezeichnung der Serie AK505 wurde geändert. Es handelt sich hierbei um AK500 in horizontaler Ausführung.

## Board
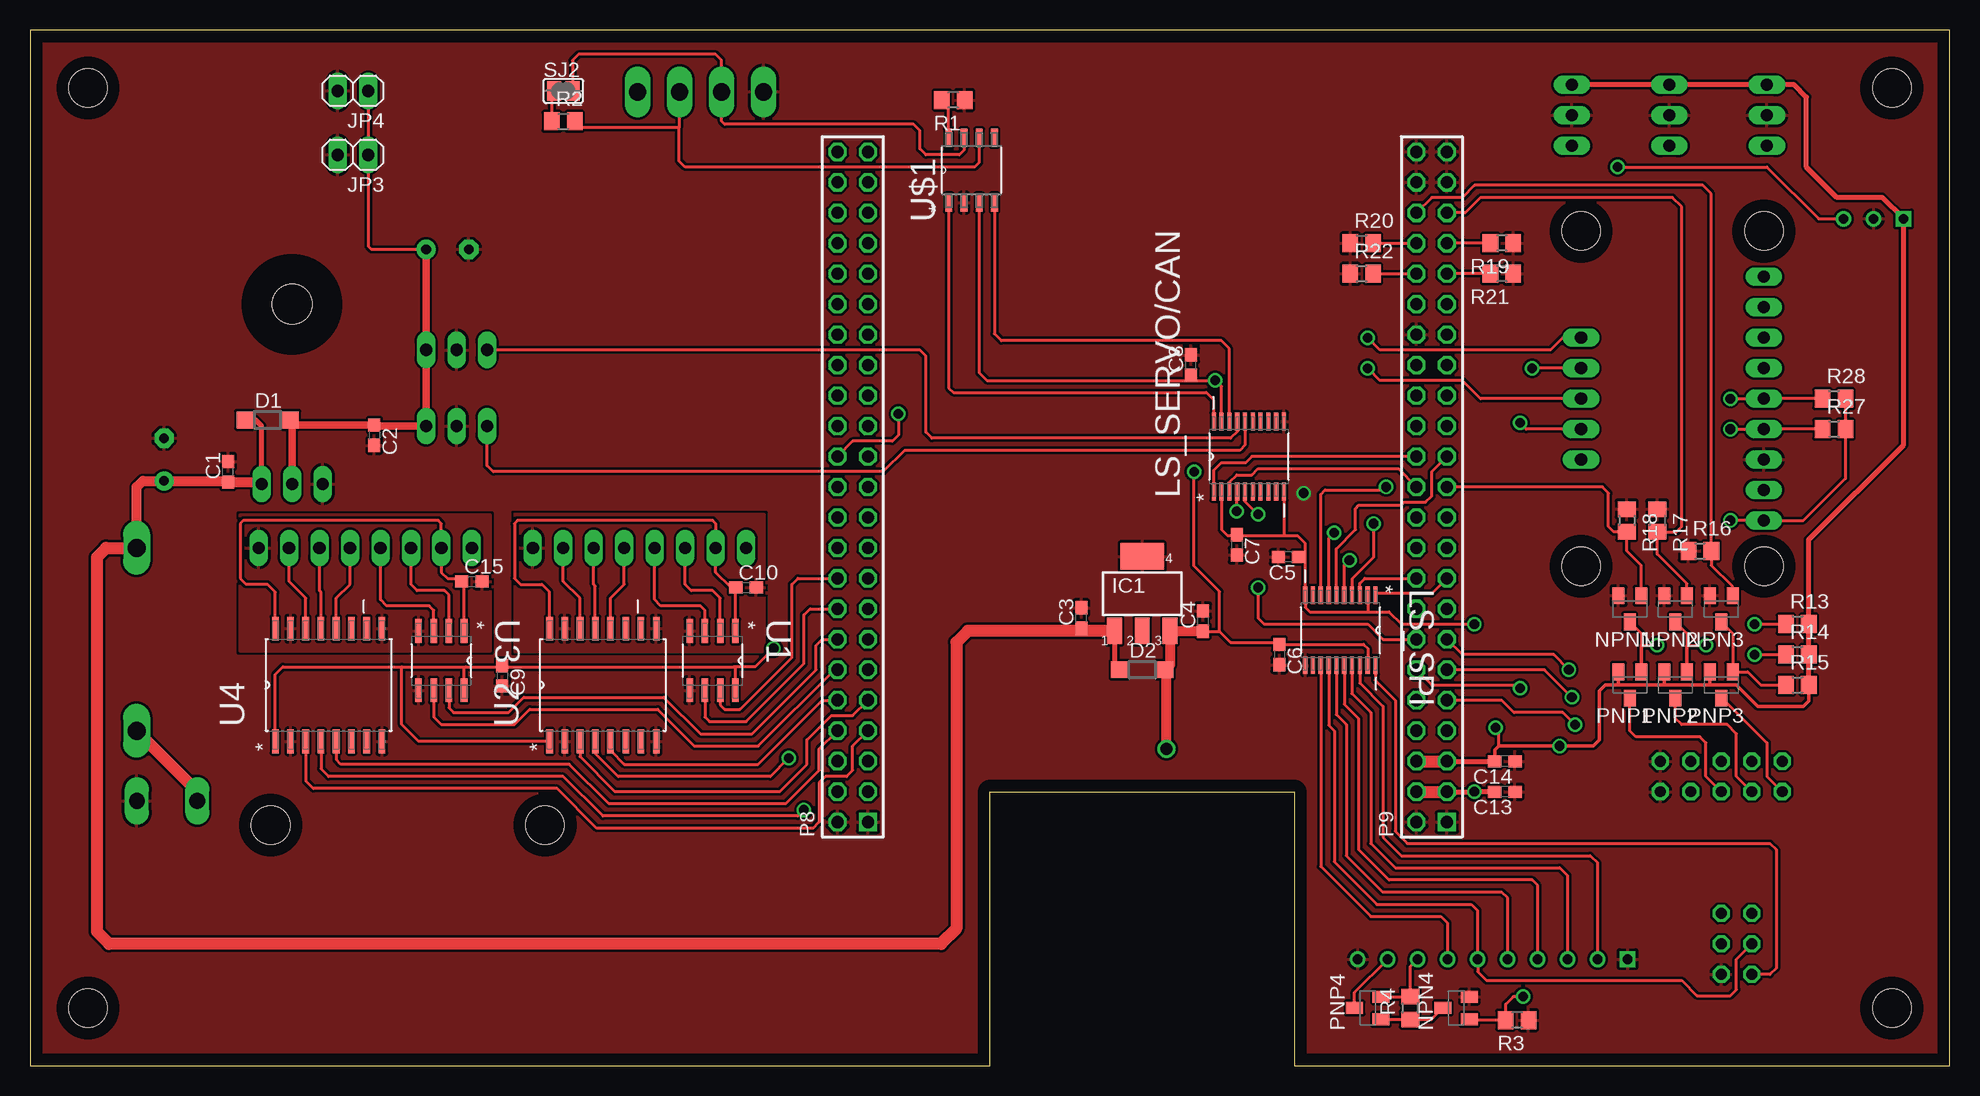
[diagram p7: board, top side]
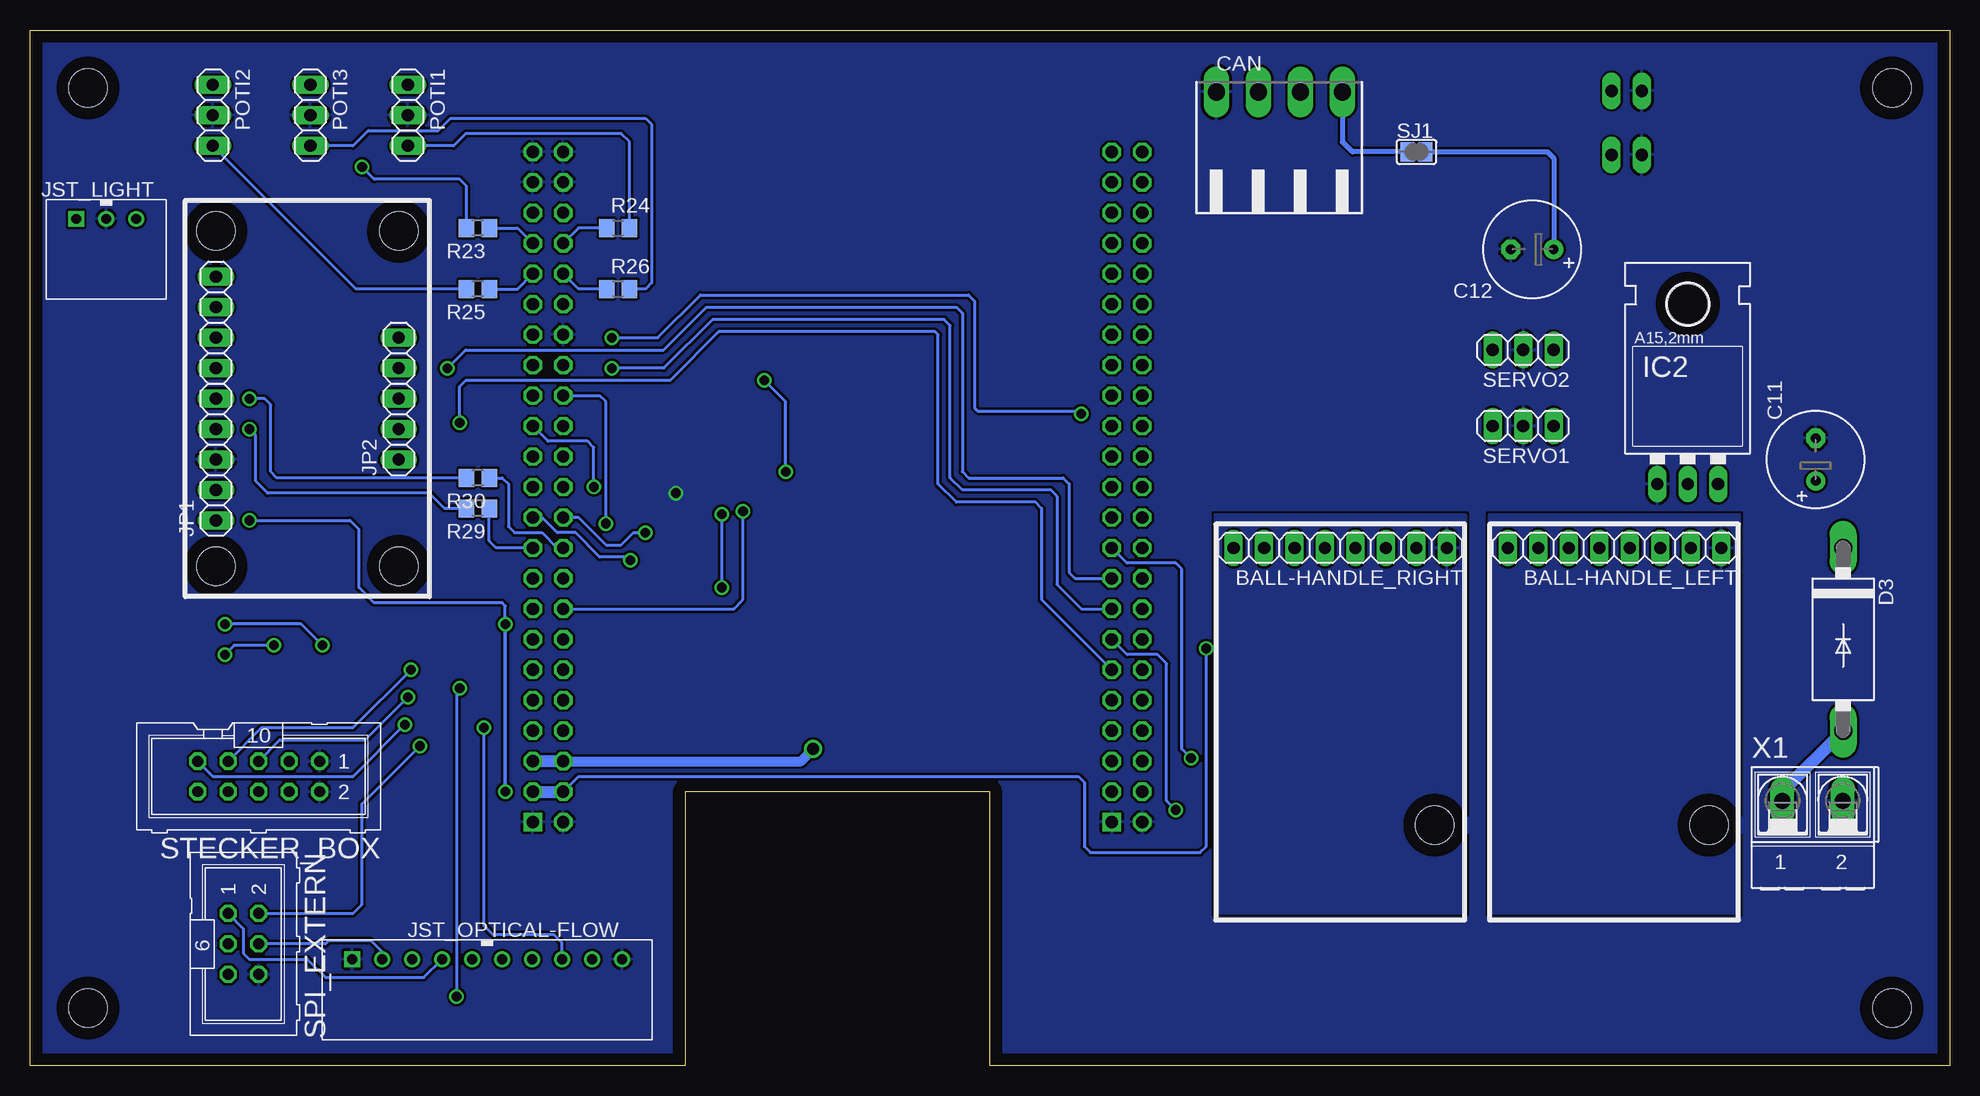
[diagram p8: board, bottom side, seen from below]

Size 160.02 x 86.36 mm. Coordinates in mm from the lower left corner, seen from the top.
Outline: 0,0 80.01,0 80.01,22.86 105.41,22.86 105.41,0 160.02,0 160.02,86.36 0,86.36 0,0
Copper layers (1*16): Top 0.035mm / dielectric 1.5mm / Bottom 0.035mm
Design rules "default *": minimum track width 10mil, minimum drill 24mil, track to track 8mil, track to pad 8mil, pad to pad 8mil, via to via 8mil, smd to smd 8mil, copper to edge 40mil, drill to drill 8mil, minimum pad ring 10mil, minimum via ring 8mil, stop-mask expansion 4mil, vias tented up to drill 0mil, thermal gap 10mil
Holes 3.2 mm at 129.29,69.6 144.53,69.6 129.29,41.66 144.53,41.66 4.83,4.83 155.19,4.83 155.19,81.53 4.83,81.53 20.07,20.07 42.93,20.07

### Footprints (pad centres in the part's own frame; a part is rotated, then mirrored left to right if it is on the bottom)
1X08 = drill 1.016 long: 1 -8.89,0; 2 -6.35,0; 3 -3.81,0; 4 -1.27,0; 5 1.27,0; 6 3.81,0; 7 6.35,0; 8 8.89,0
C0603 = smd 1.1 x 1: 1 -0.85,0; 2 0.85,0
E3,5-8 = drill 0.813 pad 1.6: + -1.778,0 | drill 0.813 pad 1.6 octagon: - 1.778,0
90-4 = drill 1.422 long: 1 -5.25,5.25; 2 -1.75,5.25; 3 1.75,5.25; 4 5.25,5.25
SOD123 = smd 1.4 x 1.4: A 1.9,0; C -1.9,0
DO27-15 = drill 1.499 long: A 7.62,0; C -7.62,0
SOT223 = smd 1.219 x 2.235: 1 -2.311,-3.099; 2 0,-3.099; 3 2.311,-3.099 | smd 3.6 x 2.2: 4 0,3.099
TO220L1 = drill 1.016 long: 1 -2.54,-3.81; 2 0,-3.81; 3 2.54,-3.81 | hole 3.302: 0,11.176
1X09 = drill 1.016 long: 1 -10.16,0; 2 -7.62,0; 3 -5.08,0; 4 -2.54,0; 5 0,0; 6 2.54,0; 7 5.08,0; 8 7.62,0; 9 10.16,0
1X05 = drill 1.016 long: 1 -5.08,0; 2 -2.54,0; 3 0,0; 4 2.54,0; 5 5.08,0
1X02 = drill 1.016 long: 1 -1.27,0; 2 1.27,0
S3B-EH = drill 0.813 square: 1 2.5,0 | drill 0.813: 2 0,0; 3 -2.5,0
S10B-EH = drill 0.813 square: 1 11.25,0 | drill 0.813: 2 8.75,0; 3 6.25,0; 4 3.75,0; 5 1.25,0; 6 -1.25,0; 7 -3.75,0; 8 -6.25,0; 9 -8.75,0; 10 -11.25,0
SOP65P640X120-20N = smd 1.473 x 0.356: 1 -2.921,2.921; 2 -2.921,2.286; 3 -2.921,1.626; 4 -2.921,0.965; 5 -2.921,0.33; 6 -2.921,-0.33; 7 -2.921,-0.965; 8 -2.921,-1.626; 9 -2.921,-2.286; 10 -2.921,-2.921; 11 2.921,-2.921; 12 2.921,-2.286; 13 2.921,-1.626; 14 2.921,-0.965; 15 2.921,-0.33; 16 2.921,0.33; 17 2.921,0.965; 18 2.921,1.626; 19 2.921,2.286; 20 2.921,2.921
SOT23-BEC = smd 1 x 1.4: B -0.95,-1.1; C 0,1.1; E 0.95,-1.1
2X23 = drill 1.016 square: 1 -26.67,-1.27 | drill 1.016 octagon: 2 -26.67,1.27; 3 -24.13,-1.27; 4 -24.13,1.27; 5 -21.59,-1.27; 6 -21.59,1.27; 7 -19.05,-1.27; 8 -19.05,1.27; 9 -16.51,-1.27; 10 -16.51,1.27; 11 -13.97,-1.27; 12 -13.97,1.27; 13 -11.43,-1.27; 14 -11.43,1.27; 15 -8.89,-1.27; 16 -8.89,1.27; 17 -6.35,-1.27; 18 -6.35,1.27; 19 -3.81,-1.27; 20 -3.81,1.27; 21 -1.27,-1.27; 22 -1.27,1.27; 23 1.27,-1.27; 24 1.27,1.27; 25 3.81,-1.27; 26 3.81,1.27; 27 6.35,-1.27; 28 6.35,1.27; 29 8.89,-1.27; 30 8.89,1.27; 31 11.43,-1.27; 32 11.43,1.27; 33 13.97,-1.27; 34 13.97,1.27; 35 16.51,-1.27; 36 16.51,1.27; 37 19.05,-1.27; 38 19.05,1.27; 39 21.59,-1.27; 40 21.59,1.27; 41 24.13,-1.27; 42 24.13,1.27; 43 26.67,-1.27; 44 26.67,1.27; 45 29.21,-1.27; 46 29.21,1.27
1X03 = drill 1.016 long: 1 -2.54,0; 2 0,0; 3 2.54,0
R0805 = smd 1.3 x 1.5: 1 -0.95,0; 2 0.95,0
SJ = smd 1.168 x 1.6: 1 -0.762,0; 2 0.762,0
ML6 = drill 0.914 octagon: 1 -2.54,-1.27; 2 -2.54,1.27; 3 0,-1.27; 4 0,1.27; 5 2.54,-1.27; 6 2.54,1.27
ML10 = drill 0.914 octagon: 1 -5.08,-1.27; 2 -5.08,1.27; 3 -2.54,-1.27; 4 -2.54,1.27; 5 0,-1.27; 6 0,1.27; 7 2.54,-1.27; 8 2.54,1.27; 9 5.08,-1.27; 10 5.08,1.27
SOIC127P600X175-8N = smd 1.981 x 0.559: 1 -2.464,1.905; 2 -2.464,0.635; 3 -2.464,-0.635; 4 -2.464,-1.905; 5 2.464,-1.905; 6 2.464,-0.635; 7 2.464,0.635; 8 2.464,1.905
SOIC127P1032X265-16N = smd 1.981 x 0.559: 1 -4.699,4.445; 2 -4.699,3.175; 3 -4.699,1.905; 4 -4.699,0.635; 5 -4.699,-0.635; 6 -4.699,-1.905; 7 -4.699,-3.175; 8 -4.699,-4.445; 9 4.699,-4.445; 10 4.699,-3.175; 11 4.699,-1.905; 12 4.699,-0.635; 13 4.699,0.635; 14 4.699,1.905; 15 4.699,3.175; 16 4.699,4.445
SOIC127P600X175-8N' = smd 1.473 x 0.559: 1 -2.718,1.905; 2 -2.718,0.635; 3 -2.718,-0.635; 4 -2.718,-1.905; 5 2.718,-1.905; 6 2.718,-0.635; 7 2.718,0.635; 8 2.718,1.905
AK500/2-H = drill 1.321 long: 1 -2.515,0; 2 2.515,0

### Placement (x,y rotation side)
BALL-HANDLE_LEFT  27.94,43.18 180 bottom
BALL-HANDLE_RIGHT  50.8,43.18 180 bottom
C1  16.51,49.53 90 top
C2  28.7,52.58 270 top
C3  87.63,37.34 90 top
C4  97.79,37.08 90 top
C5  104.9,42.42 180 top
C6  104.14,34.29 270 top
C7  100.58,43.43 270 top
C8  96.77,58.42 90 top
C9  39.37,32.51 270 top
C10  59.69,39.88 0 top
C11  11.18,50.55 90 bottom
C12  34.8,68.07 180 bottom
C13  122.94,22.86 180 top
C14  122.94,25.4 180 top
C15  36.83,40.39 0 top
CAN  55.88,75.95 0 bottom
D1  19.81,53.85 0 top
D2  92.71,33.02 0 top
D3  8.89,35.56 270 bottom
IC1  92.71,39.37 0 top
IC2  21.84,52.32 0 bottom
JP1  144.53,55.63 90 bottom
JP2  129.29,55.63 90 bottom
JP3  26.92,75.95 180 top
JP4  26.92,81.28 180 top
JST_LIGHT  153.67,70.61 180 bottom
JST_OPTICAL-FLOW  121.92,8.89 180 bottom
LS_SERVO/CAN  101.6,50.8 90 top
LS_SPI  109.22,36.32 270 top
NPN1  133.35,38.1 180 top
NPN2  137.16,38.1 180 top
NPN3  140.97,38.1 180 top
NPN4  118.87,4.83 90 top
P8  68.58,46.99 90 top
P9  116.84,46.99 90 top
PNP1  133.35,31.75 180 top
PNP2  137.16,31.75 180 top
PNP3  140.97,31.75 180 top
PNP4  111.51,4.83 90 top
POTI1  128.52,79.25 270 bottom
POTI2  144.78,79.25 270 bottom
POTI3  136.65,79.25 270 bottom
R1  76.96,80.52 180 top
R2  44.45,78.74 0 top
R3  123.95,3.81 180 top
R4  115.06,4.83 90 top
R13  147.32,36.83 0 top
R14  147.32,34.29 0 top
R15  147.32,31.75 0 top
R16  139.19,42.93 0 top
R17  135.64,45.47 270 top
R18  133.1,45.47 270 top
R19  122.68,68.58 180 top
R20  111,68.58 0 top
R21  122.68,66.04 180 top
R22  111,66.04 0 top
R23  122.68,69.85 180 bottom
R24  111,69.85 0 bottom
R25  122.68,64.77 180 bottom
R26  111,64.77 0 bottom
R27  150.37,53.09 0 top
R28  150.37,55.63 0 top
R29  122.68,46.48 180 bottom
R30  122.68,49.02 180 bottom
SERVO1  35.56,53.34 180 bottom
SERVO2  35.56,59.69 180 bottom
SJ1  44.45,76.2 0 bottom
SJ2  44.45,81.28 0 top
SPI_EXTERN  142.24,10.16 270 bottom
STECKER_BOX  140.97,24.13 180 bottom
U1  56.9,33.78 270 top
U2  47.75,31.75 90 top
U3  34.29,33.78 270 top
U4  24.89,31.75 90 top
U$1  MCP2551-I/SN  [SOIC127P600X175-8N']  78.49,74.68 90 top
X1  11.43,22.1 0 bottom

### Tracks (layer width: path | path; a pad name or v marks a point on that pad's centre or on a via)
5V/2_F&J
  Bottom 0.406: SJ1.1 49.78,76.2 50.63,77.05 CAN.4
!BH_L_RESET
  Top 0.254: U4.12 25.53,38.99 26.67,40.13 BALL-HANDLE_LEFT.4
!BH_L_RESET_3V
  Top 0.254: U4.5 25.53,25.53 25.91,25.15 44.96,25.15 48.26,21.84 62.99,21.84 65.79,24.64 65.79,26.42 P8.8
!BH_R_RESET
  Top 0.254: U2.12 48.39,38.99 49.53,40.13 BALL-HANDLE_RIGHT.4
!BH_R_RESET_3V
  Top 0.254: P8.10 66.04,30.48 60.71,25.15 49.53,25.15 48.39,26.29 U2.5
+3V3  (via drill 0.8)
  Top 0.254: U4.1 20.45,32.64 21.08,33.27 30.99,33.27 | 30.99,33.27 36.32,33.27 | 36.32,33.27 39.37,33.27 | 39.37,33.27 58.67,33.27 | U1.8 58.8,33.15 58.67,33.27 | U3.8 36.2,33.15 36.32,33.27 | U2.1 32.38,27.05 30.99,28.45 30.99,33.27 | LS_SERVO/CAN.2 99.31,44.7 99.82,44.2 100.58,44.2 | 100.58,44.2 104.65,44.2 | 104.65,44.2 105.66,44.2 106.3,43.56 106.3,42.42 | 106.3,42.42 LS_SPI.10 106.3,38.23 106.68,37.85 111.51,37.85 | LS_SERVO/CAN.10 104.52,44.32 104.65,44.2 | C7.1 100.58,44.2 | C5.1 106.3,42.42 | R28.2 R27.2 151.32,48.96 147.83,45.47 JP1.1 v141.73,45.47 | v61.98,34.8 60.45,33.27 58.67,33.27 | C9.1 39.37,33.27 | LS_SPI.2 111.51,37.85 | 111.51,37.85 113.28,37.85 114.3,36.83 v120.4,36.83
  Top 0.406: P9.3 v120.4,22.86 C13.2
  Top 1.016: P9.4 P9.3
  Bottom 0.254: P9.4 114.3,24.13 72.64,24.13 72.14,23.62 72.14,18.29 71.63,17.78 62.48,17.78 61.98,18.29 v61.98,34.8 | v141.73,45.47 133.35,45.47 132.59,44.7 132.59,39.88 131.32,38.61 120.65,38.61 120.4,38.35 v120.4,36.83
  Bottom 0.305: v120.4,22.86 v120.4,36.83
  Bottom 1.016: P9.3 P9.4
+5V/1  (via drill 0.8, 1)
  Top 0.254: U$1.3 79.12,57.78 79.76,57.15 97.03,57.15 | 97.03,57.15 v98.81,57.15 99.31,56.64 LS_SERVO/CAN.19 | C4.1 99.15,36.23 | 99.15,36.23 100.08,35.31 103.97,35.31 C6.1 111.16,35.14 111.51,34.8 LS_SPI.19 | JST_OPTICAL-FLOW.8 115.06,8.28 R4.2 PNP4.E | C8.1 96.77,57.4 97.03,57.15 | 99.15,36.23 99.15,39.54 97.03,41.66 v97.03,49.53 | 122.43,26.67 122.43,27.94 v122.17,28.19
  Top 0.305: C14.2 122.09,26.33 122.43,26.67 v127.51,26.67 130.3,26.67 130.81,27.18 130.81,31.24 131.32,31.75 132.33,31.75 | 132.33,31.75 136.14,31.75 | 136.14,31.75 139.95,31.75 | 139.95,31.75 142.24,31.75 144.02,29.97 147.83,29.97 148.27,30.41 R15.2 | PNP1.E 132.4,31.82 132.33,31.75 | PNP2.E 136.21,31.82 136.14,31.75 | PNP3.E 140.02,31.82 139.95,31.75
  Top 0.406: P9.5 C14.2 | R15.2 R14.2 R13.2 148.27,43.88 156.17,51.78 JST_LIGHT.1 154.39,72.39 150.62,72.39 148.08,74.93 148.08,80.77 147.07,81.79 POTI2.1 POTI3.1 POTI1.1
  Top 0.813: v94.74,26.42 94.74,32.89 D2.A 95.02,33.43 IC1.3 97.75,36.27 C4.1
  Top 1.016: P9.6 P9.5
  Bottom 0.254: v97.03,49.53 97.03,55.37 v98.81,57.15 | SPI_EXTERN.2 133.1,12.7 132.33,13.46 132.33,21.84 v127.51,26.67 | JST_OPTICAL-FLOW.8 115.67,10.26 116.33,10.92 121.41,10.92 122.17,11.68 v122.17,28.19
  Bottom 0.813: P9.6 95.76,25.4 v94.74,26.42
  Bottom 1.016: P9.6 P9.5
+5V/2
  Top 0.254: JP4.1 JP3.1 28.19,68.33 28.45,68.07 C12.+
  Top 0.61: IC2.2 21.84,53.34 | 21.84,53.34 21.84,53.72 D1.A | 21.84,53.34 21.93,53.43 C2.1 28.79,53.34 SERVO1.1 SERVO2.1 C12.+
  Bottom 0.406: SJ1.2 33.53,76.2 33.02,75.69 C12.+
+5V/3
  Top 0.254: U1.1 58.8,39.84 C10.1 58.42,39.88 57.15,41.15 BALL-HANDLE_RIGHT.7 57.15,45.21 56.9,45.47 40.64,45.47 40.39,45.21 40.39,40.64 40.89,40.13 42.67,40.13 43.31,39.5 U2.16
+5V/4
  Top 0.254: U3.1 36.2,40.17 C15.1 35.73,40.64 34.8,40.64 34.29,41.15 BALL-HANDLE_LEFT.7 34.29,45.21 34.04,45.47 17.78,45.47 17.53,45.21 17.53,40.64 18.03,40.13 19.81,40.13 20.45,39.5 U4.16
+10V
  Top 0.406: IC2.3 19.3,53.34 18.8,53.85 D1.C | IC1.1 90.4,33.43 D2.C
  Top 0.813: D3.C 8.89,48.26 9.4,48.77 C11.+ 16.42,48.77 C1.1 19.14,48.68 IC2.3
  Top 1.016: D3.C 6.35,43.18 5.59,42.42 5.59,11.18 6.6,10.16 75.95,10.16 77.22,11.43 77.22,35.31 78.18,36.27 IC1.1 87.85,36.27 C3.1
+12V
  Top 1.016: D3.A 13.95,22.89 X1.1
  Bottom 1.016: X1.1 13.95,22.89 D3.A
ADC0_1.8V
  Top 0.254: R19.2 P9.39
  Bottom 0.254: R23.1 119.38,69.85 P9.39
ADC1
  Bottom 0.254: R24.2 110.05,77.03 110.74,77.72 123.7,77.72 124.71,76.71 POTI1.3
ADC1_1.8V
  Top 0.254: R20.2 P9.40
  Bottom 0.254: R24.1 114.3,69.85 P9.40
ADC2
  Bottom 0.254: R25.2 132.84,64.77 POTI2.3
ADC2_1.8V
  Top 0.254: R21.2 P9.37
  Bottom 0.254: R25.1 119.38,64.77 P9.37
ADC3
  Bottom 0.254: R26.2 108.71,64.77 108.2,65.28 108.2,78.49 108.71,78.99 124.97,78.99 125.98,77.98 131.83,77.98 133.1,76.71 POTI3.3
ADC3_1.8V
  Top 0.254: R22.2 P9.38
  Bottom 0.254: R26.1 114.3,64.77 P9.38
BH_L_DIR
  Top 0.254: U4.14 22.99,38.99 21.59,40.39 BALL-HANDLE_LEFT.2
BH_L_DIR_3V
  Top 0.254: P8.7 68.58,26.67 68.58,24.64 68.07,24.13 66.29,24.13 65.79,23.62 65.79,20.32 65.28,19.81 47.24,19.81 43.94,23.11 23.62,23.11 22.99,23.75 U4.3
BH_L_FF1
  Top 0.254: U3.3 33.66,37.97 33.27,38.35 29.72,38.35 29.21,38.86 BALL-HANDLE_LEFT.5
BH_L_FF1_3V
  Top 0.254: U3.6 33.66,29.08 34.29,28.45 40.39,28.45 41.66,29.72 52.32,29.72 55.37,26.67 60.71,26.67 67.06,33.02 P8.12
BH_L_FF2
  Top 0.254: U3.2 34.92,39.24 34.54,39.62 32.26,39.62 31.75,40.13 BALL-HANDLE_LEFT.6
BH_L_FF2_3V
  Top 0.254: U3.7 34.92,29.84 35.31,29.46 39.88,29.46 41.15,30.73 52.83,30.73 55.88,27.69 60.2,27.69 65.53,33.02 65.53,35.05 66.04,35.56 P8.14
BH_L_PWM
  Top 0.254: U4.13 24.26,39.5 24.13,39.62 BALL-HANDLE_LEFT.3
BH_L_PWM_3V  (via drill 0.8)
  Top 0.254: v64.52,21.34 64.01,20.83 47.75,20.83 44.45,24.13 24.89,24.13 24.26,24.77 U4.4
  Bottom 0.254: P8.13 68.58,34.29 66.04,34.29 65.28,33.53 65.28,22.1 v64.52,21.34
BH_R_DIR
  Top 0.254: U2.14 45.85,38.99 44.45,40.39 BALL-HANDLE_RIGHT.2
BH_R_DIR_3V
  Top 0.254: P8.9 68.58,29.21 66.8,29.21 64.77,27.18 64.77,25.15 62.48,22.86 48.77,22.86 45.85,25.78 U2.3
BH_R_FF1
  Top 0.254: U1.3 56.26,37.97 55.88,38.35 52.58,38.35 52.07,38.86 BALL-HANDLE_RIGHT.5
BH_R_FF1_3V
  Top 0.254: U1.6 56.26,29.08 56.64,28.7 59.69,28.7 64.52,33.53 64.52,37.59 65.02,38.1 P8.16
BH_R_FF2
  Top 0.254: U1.2 57.53,38.99 56.9,39.62 55.12,39.62 54.61,40.13 BALL-HANDLE_RIGHT.6
BH_R_FF2_3V
  Top 0.254: U1.7 57.53,30.1 57.91,29.72 59.18,29.72 63.5,34.04 63.5,40.13 64.01,40.64 P8.18
BH_R_PWM
  Top 0.254: U2.13 47.12,40.01 46.99,40.13 BALL-HANDLE_RIGHT.3
BH_R_PWM_3V  (via drill 0.8)
  Top 0.254: v63.25,25.65 61.72,24.13 49.02,24.13 47.12,26.04 U2.4
  Bottom 0.254: v63.25,25.65 64.01,26.42 64.01,41.4 64.52,41.91 68.58,41.91 P8.19
CAN_RX
  Top 0.254: LS_SERVO/CAN.18 99.97,59.79 99.31,60.45 80.97,60.45 80.39,61.04 U$1.4
CAN_RX_3V
  Top 0.254: P9.24 114.05,49.78 102.36,49.78 101.85,49.28 100.58,49.28 99.97,48.67 LS_SERVO/CAN.3
CAN_TX
  Top 0.254: LS_SERVO/CAN.20 98.68,55.5 98.17,56.01 98.04,56.13 76.96,56.13 76.58,56.52 U$1.1
CAN_TX_3V
  Top 0.254: P9.26 101.85,50.8 101.35,50.29 99.31,50.29 98.68,49.66 LS_SERVO/CAN.1
CANH
  Top 0.254: U$1.7 77.85,76.33 77.47,75.95 74.68,75.95 74.17,76.45 74.17,77.98 73.66,78.49 57.91,78.49 57.66,78.74 57.66,81.42 CAN.2 57.63,83.85 57.15,84.33 45.72,84.33 45.21,83.82 SJ2.2
CANL
  Top 0.254: U$1.6 79.12,75.31 78.74,74.93 54.61,74.93 54.1,75.44 54.1,78.23 | CAN.3 54.1,81.42 54.1,78.23 | 54.1,78.23 45.91,78.23 R2.2
DRDY  (via drill 0.8)
  Top 0.254: v111.51,58.17 112.52,57.15 119.38,57.15 120.9,55.63 JP2.3
  Bottom 0.254: v111.51,58.17 107.19,58.17 103.12,62.23 83.82,62.23 83.31,61.72 83.31,49.02 82.3,48.01 74.93,48.01 74.42,47.5 74.42,40.13 72.39,38.1 P8.15
GND  (via drill 0.8)
  other vias: 106.17,47.75
  pour Bottom (rank 6): 0,86.36 160.02,86.36 160.02,0 0,0
  pour Top (rank 6): 0,86.36 160.02,86.36 160.02,0 0,0
GND3
  pour Top: 40.39,45.97 40.39,34.54 61.21,34.54 61.21,45.97
  pour Bottom: 40.39,45.97 40.39,12.7 61.21,12.7 61.21,45.97
GND4
  pour Top: 17.53,45.97 38.35,45.97 38.35,34.54 17.53,34.54
  pour Bottom: 17.53,45.97 17.53,12.7 38.35,12.7 38.35,45.97
I2C2_SCL
  Bottom 0.254: P9.19 121.16,43.18 121.73,43.75 R29.1
I2C2_SDA
  Bottom 0.254: R30.1 120.65,49.02 120.14,48.51 120.14,44.96 119.63,44.45 117.35,44.45 116.08,43.18 P9.20
INT1  (via drill 0.8)
  Top 0.254: JP2.4 v125.22,58.17
  Bottom 0.254: v125.22,58.17 123.7,59.69 107.19,59.69 103.63,63.25 82.8,63.25 82.3,62.74 82.3,49.53 81.79,49.02 73.91,49.02 73.41,48.51 73.41,41.15 72.9,40.64 P8.17
INT2  (via drill 0.8)
  Top 0.254: v111.51,60.71 112.52,59.69 126.75,59.69 127.76,60.71 JP2.5 | v72.39,54.36 72.39,52.58 71.88,52.07 68.58,52.07 P8.26
  Bottom 0.254: v111.51,60.71 107.7,60.71 104.14,64.26 81.79,64.26 81.28,63.75 81.28,54.86 81.03,54.61 72.64,54.61 v72.39,54.36
INTG  (via drill 0.8)
  Top 0.254: JP2.2 124.71,53.09 v124.21,53.59
  Bottom 0.254: v124.21,53.59 124.21,56.64 123.7,57.15 106.68,57.15 102.62,61.21 84.58,61.21 84.33,60.96 84.33,48.51 82.8,46.99 76.2,46.99 75.69,46.48 75.69,38.86 P8.11
LB_ADC  (via drill 0.8)
  Top 0.254: v132.33,74.93 144.78,74.93 149.1,70.61 JST_LIGHT.3
  Bottom 0.254: R23.2 123.63,73.34 124.21,73.91 131.32,73.91 v132.33,74.93
N$1  (via drill 0.8)
  Top 0.254: NPN1.C 134.3,36.05 PNP1.B 134.3,35.05 v135.64,35.05 | v143.76,36.83 R13.1
  Bottom 0.254: v135.64,35.05 137.41,36.83 v143.76,36.83
N$2  (via drill 0.8)
  Top 0.254: NPN2.C 138.11,36.05 PNP2.B 138.11,35.05 v139.7,35.05 | v143.76,34.29 R14.1
  Bottom 0.254: v139.7,35.05 143,35.05 v143.76,34.29
N$3
  Top 0.254: PNP4.B R4.1 116.82,3.88 NPN4.C
N$4
  Top 0.254: NPN3.C 141.92,36.05 PNP3.B 143.17,32.85 144.27,31.75 R15.1
N$9
  Top 0.254: U$1.8 76.58,79.95 R1.2
N$10
  Top 0.254: R2.1 43.5,81.09 SJ2.1
OF_LED
  Top 0.254: PNP4.C 110.41,6.13 JST_OPTICAL-FLOW.9
OF_LED_3V  (via drill 0.8)
  Top 0.254: v124.46,5.78 123.63,5.78 123,5.15 R3.2 120.04,3.81 NPN4.B | P9.12 116.84,31.75 123.95,31.75 v124.21,31.5
  Bottom 0.254: v124.46,5.78 124.46,31.24 v124.21,31.5
OF_NCS
  Top 0.254: LS_SPI.17 110.19,31.04 111.76,29.46 111.76,18.54 113.79,16.51 127.51,16.51 128.17,15.85 JST_OPTICAL-FLOW.3
OF_NCS_3V  (via drill 0.8)
  Top 0.254: LS_SPI.4 110.24,39.29 110.24,40.64 112.01,42.42 v112.01,45.21
  Bottom 0.254: P9.30 112.52,55.88 112.01,55.37 v112.01,45.21
OF_NPD
  Top 0.254: LS_SPI.15 108.89,29.29 109.73,28.45 109.73,17.53 112.78,14.48 122.68,14.48 123.17,13.99 JST_OPTICAL-FLOW.5
OF_NPD_3V
  Top 0.254: P9.25 116.84,49.53 116.84,47.5 116.33,46.99 114.55,46.99 114.3,46.74 110.74,46.74 110.49,46.48 110.49,44.7 108.89,43.1 LS_SPI.6
OF_RST
  Top 0.254: LS_SPI.13 107.59,16.61 111.76,12.45 117.6,12.45 118.17,11.88 JST_OPTICAL-FLOW.7
OF_RST_3V  (via drill 0.8)
  Top 0.254: v113.03,48.26 112.78,48.01 107.95,48.01 107.59,47.65 LS_SPI.8
  Bottom 0.254: v113.03,48.26 113.03,51.56 113.54,52.07 116.84,52.07 P9.27
SCL  (via drill 0.8)
  Top 0.254: R27.1 JP1.4 v141.73,53.09
  Bottom 0.254: R29.2 125.48,46.48 126.75,47.75 140.21,47.75 141.22,48.77 141.22,52.58 v141.73,53.09
SDA  (via drill 0.8)
  Top 0.254: R28.1 JP1.5 v141.73,55.63
  Bottom 0.254: R30.2 139.45,49.02 139.95,49.53 139.95,55.12 140.46,55.63 v141.73,55.63
SERVO_PWM
  Top 0.254: LS_SERVO/CAN.16 101.27,51.74 100.84,51.31 72.9,51.31 71.12,49.53 38.61,49.53 38.1,50.04 SERVO1.3
SERVO_PWM2
  Top 0.254: LS_SERVO/CAN.17 100.64,52.88 100.08,52.32 75.18,52.32 74.68,52.83 74.68,59.18 74.17,59.69 SERVO2.3
SERVO_PWM2_3V  (via drill 0.8)
  Top 0.254: v100.58,46.23 100.58,47.83 LS_SERVO/CAN.4
  Bottom 0.254: P9.16 101.35,38.1 100.58,38.86 v100.58,46.23
SERVO_PWM_3V  (via drill 0.8)
  Top 0.254: LS_SERVO/CAN.5 101.27,47.07 v102.36,45.97 | v102.36,39.88 102.36,37.34 102.87,36.83 111.51,36.83 112.78,35.56 P9.14
  Bottom 0.254: v102.36,45.97 v102.36,39.88
SPI0_CLK  (via drill 0.8)
  Top 0.254: LS_SPI.7 108.25,43.99 v108.71,44.45
  Bottom 0.254: P9.22 114.3,45.72 112.01,43.43 110.74,43.43 109.73,44.45 v108.71,44.45
SPI0_CS
  Top 0.254: P9.17 116.84,39.37 112.27,39.37 LS_SPI.1
SPI0_D0_MISO  (via drill 0.8)
  Top 0.254: LS_SPI.5 109.55,41.73 v109.98,42.16
  Bottom 0.254: P9.21 117.35,45.72 116.08,44.45 114.55,44.45 112.52,42.42 110.24,42.42 v109.98,42.16
SPI0_D1_MOSI
  Top 0.254: LS_SPI.3 110.85,40.23 111.25,40.64 P9.18
SPI_CLK
  Top 0.254: LS_SPI.14 108.25,28.4 108.71,27.94 108.71,17.02 112.27,13.46 120.14,13.46 120.67,12.93 JST_OPTICAL-FLOW.6 120.67,7.85 121.41,7.11 137.67,7.11 138.94,5.84 141.73,5.84 142.24,6.35 142.24,8.89 SPI_EXTERN.3
SPI_CS
  Top 0.254: LS_SPI.20 112.14,32.13 113.79,30.48 113.79,19.56 114.81,18.54 145.03,18.54 145.54,18.03 145.54,8.13 145.03,7.62 SPI_EXTERN.5
SPI_MISO
  Top 0.254: LS_SPI.16 109.55,30.15 110.74,28.96 110.74,18.03 113.28,15.49 125.22,15.49 125.67,15.05 JST_OPTICAL-FLOW.4
  Bottom 0.254: SPI_EXTERN.1 142.24,11.43 142.24,9.4 141.73,8.89 136.91,8.89 135.38,7.37 127.19,7.37 JST_OPTICAL-FLOW.4
SPI_MOSI
  Top 0.254: LS_SPI.18 110.85,31.9 112.78,29.97 112.78,19.05 114.3,17.53 130.05,17.53 130.67,16.9 JST_OPTICAL-FLOW.2
  Bottom 0.254: JST_OPTICAL-FLOW.2 130.67,9.51 131.57,10.41 135.13,10.41 135.38,10.16 SPI_EXTERN.4
SW_BUNDLE-LED
  Top 0.254: STECKER_BOX.8 142.24,24.13 142.24,27.69 141.48,28.45 137.67,28.45 137.16,28.96 PNP2.C
SW_BUNDLE-LED_3V
  Top 0.254: NPN2.B 138.11,40.2 135.64,42.67 R17.2 137.23,44.52 137.67,44.96 137.67,71.63 136.91,72.39 120.9,72.39 119.63,71.12 P9.41
SW_BUNDLE_3V  (via drill 0.8)
  Top 0.254: v128.27,33.02 127,34.29 119.38,34.29 P9.13
  Bottom 0.254: STECKER_BOX.7 140.72,28.19 133.1,28.19 v128.27,33.02
SW_POWER-LED
  Top 0.254: PNP3.C 141.05,30.65 144.78,26.92 144.78,24.13 STECKER_BOX.10
SW_POWER-LED_3V
  Top 0.254: NPN3.B 141.92,39.94 140.14,41.72 R16.2 140.14,72.71 139.45,73.41 120.4,73.41 119.38,72.39 116.84,72.39 P9.42
SW_PWR_BUT  (via drill 0.8)
  Top 0.254: v128.78,28.45 127.76,29.46 123.7,29.46 122.68,30.48 P9.9
  Bottom 0.254: STECKER_BOX.9 144.78,24.13 133.1,24.13 v128.78,28.45
SW_VISION-LED
  Top 0.254: STECKER_BOX.6 139.7,24.13 139.7,26.92 139.19,27.43 133.86,27.43 133.35,27.94 PNP1.C
SW_VISION-LED_3V
  Top 0.254: 134.3,39.05 NPN1.B 134.3,41.72 133.1,42.93 R18.2 132.01,44.52 131.57,44.96 131.57,47.75 131.06,48.26 P9.23
SW_VISION_3V  (via drill 0.8)
  Top 0.254: v128.52,30.73 126.24,33.02 P9.11
  Bottom 0.254: STECKER_BOX.5 139.19,27.18 132.08,27.18 v128.52,30.73